# Altium project radxa_c200_io_board_v1.11.PrjPcb (part 1 of 8)
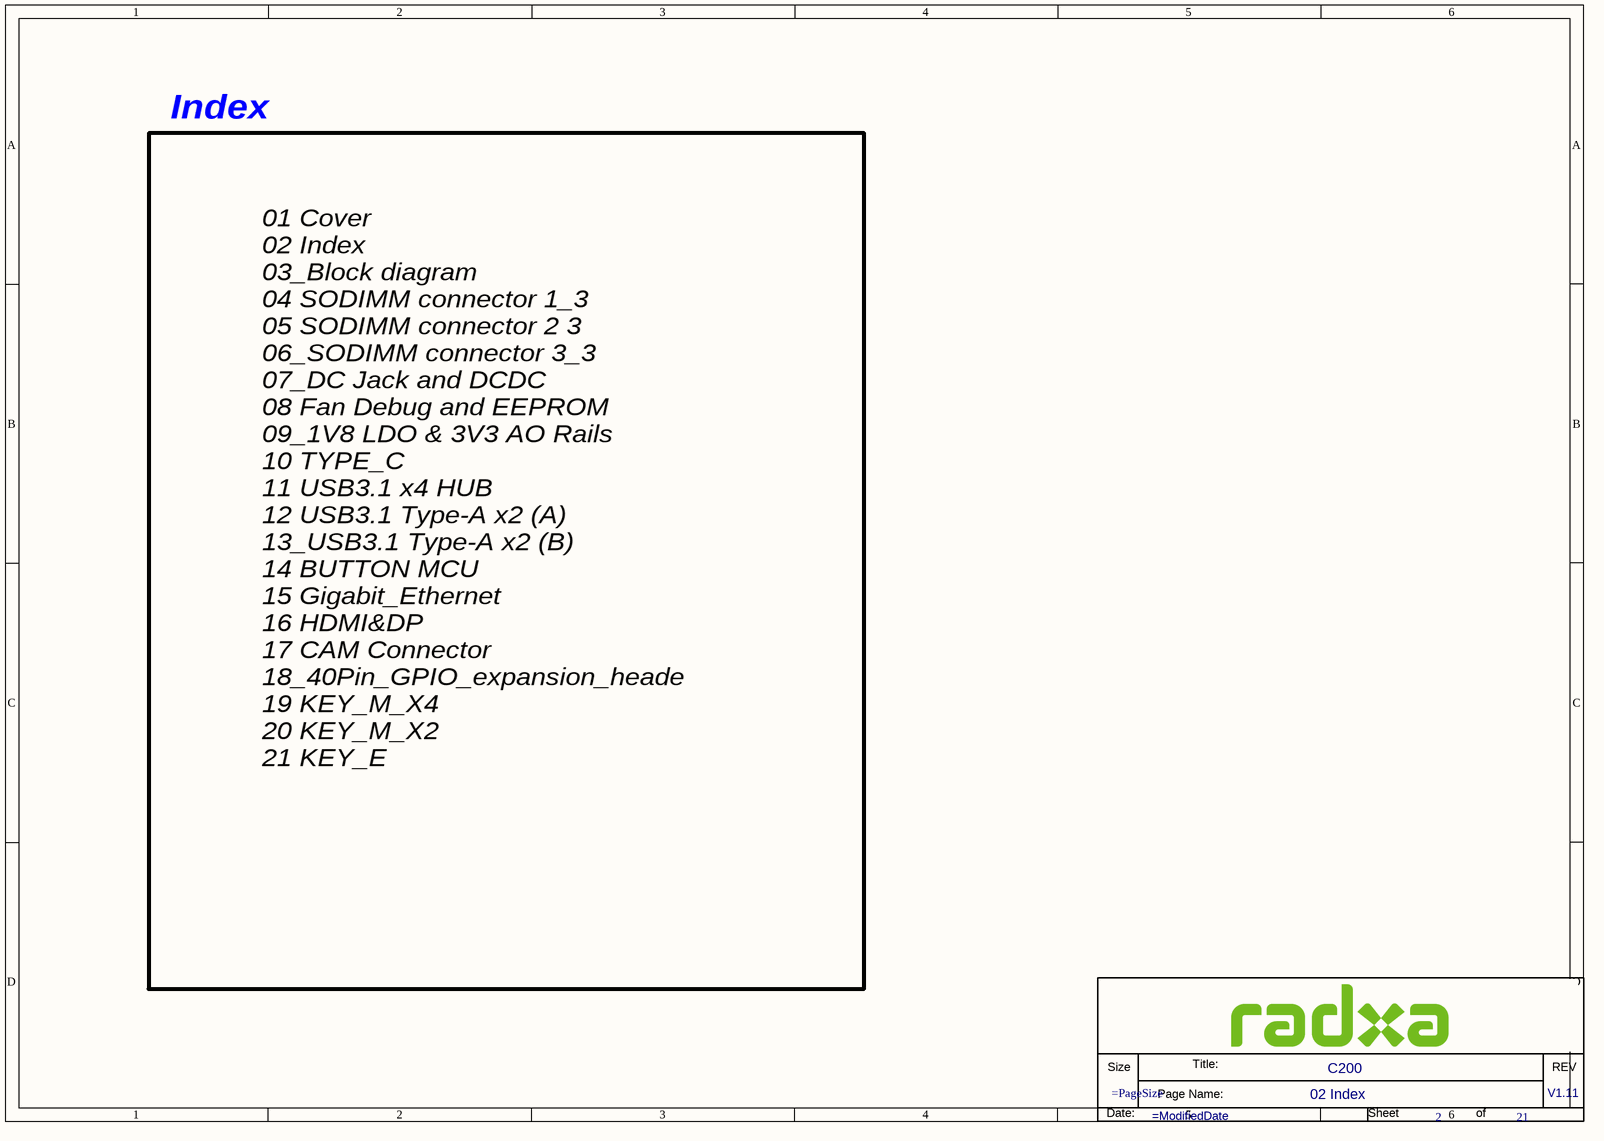
[diagram p0: 02 Index.SchDoc]
21 sheets, 649 parts. Net scope: global (net labels, ports and power ports of the same name join across sheets).
Board file: C200 V111.PcbDoc
Sheets:
  01 Cover.SchDoc
  02 Index.SchDoc
  03_Block diagram.SchDoc
  04_SODIMM connector 1_3.SchDoc
  05_SODIMM connector 2_3.SchDoc
  06_SODIMM connector 3_3.SchDoc
  07_DC Jack and DCDC.SchDoc
  08_Fan Debug and EEPROM.SchDoc
  09_1V8 LDO & 3V3 AO Rails.SchDoc
  10_TYPE_C.SchDoc
  11_USB3.1 x4 HUB.SchDoc
  12_USB3.1 Type-A x2 (A).SchDoc
  13_USB3.1 Type-A x2 (B).SchDoc
  14_BUTTON_MCU.SchDoc
  15_Gigabit_Ethernet.SchDoc
  16_HDMI&DP.SchDoc
  17_CAM_Connector.SchDoc
  18_40Pin_GPIO_expansion_heade.SchDoc
  19_KEY_M_X4.SchDoc
  20_KEY_M_X2.SchDoc
  21_KEY_E.SchDoc

## Sheet 01 Cover.SchDoc
size 297 x 209 mm; DsnPath: D:\WMS\C200\CC122\对外\C200 V1.11.DSN; SchematicName: c200; PageName: 01 Cover; PageSize: A4; TopSchematic: True

## Sheet 02 Index.SchDoc: C200
size 297 x 209 mm; Page Create Date: March  8, 1995; Page Number: 2; Page Size: A4; Comment: radxa_1010; Page Count: 21; RevCode: V1.11; Doc: 02 Index; DsnPath: D:\WMS\C200\CC122\对外\C200 V1.11.DSN; SchematicName: c200; PageName: 02 Index; PageSize: A4; TopSchematic: True

### Parts
(Parts that share a designator on the sheet are numbered #1, #2 ... from top to bottom, then left to right.)
*#1  Doc: 02 Index  RevCode: V1.11  Title: C200  Page Number: 2  Page Count: 21  (hidden comment: radxa_1010)  (graphical)

### Notes on the sheet
- Index
- 01 Cover
  02 Index
  03_Block diagram
  04 SODIMM connector 1_3
  05 SODIMM connector 2 3
  06_SODIMM connector 3_3
  07_DC Jack and DCDC
  08 Fan Debug and EEPROM
  09_1V8 LDO & 3V3 AO Rails
  10 TYPE_C
  11 USB3.1 x4 HUB
  12 USB3.1 Type-A x2 (A)
  13_USB3.1 Type-A x2 (B)
  14 BUTTON MCU
  15 Gigabit_Ethernet
  16 HDMI&DP
  17 CAM Connector
  18_40Pin_GPIO_expansion_heade
  19 KEY_M_X4
  20 KEY_M_X2
  21 KEY_E
- (in symbol radxa_1010) Size; Title:; REV; Page Name:; Date:; Sheet; of

### Library data of the parts
*#1 = radxa_1010: Page Create Date: March  8, 1995; Page Size: =PageSize; Page Modify Date: =ModifiedDate

## Sheet 03_Block diagram.SchDoc: C200
size 297 x 209 mm; Page Create Date: March  8, 1995; Page Number: 3; Page Size: A4; Comment: radxa_1010; Page Count: 21; RevCode: V1.11; Doc: 03_Block diagram; DsnPath: D:\WMS\C200\CC122\对外\C200 V1.11.DSN; SchematicName: c200; PageName: 03_Block diagram; PageSize: A4; TopSchematic: True
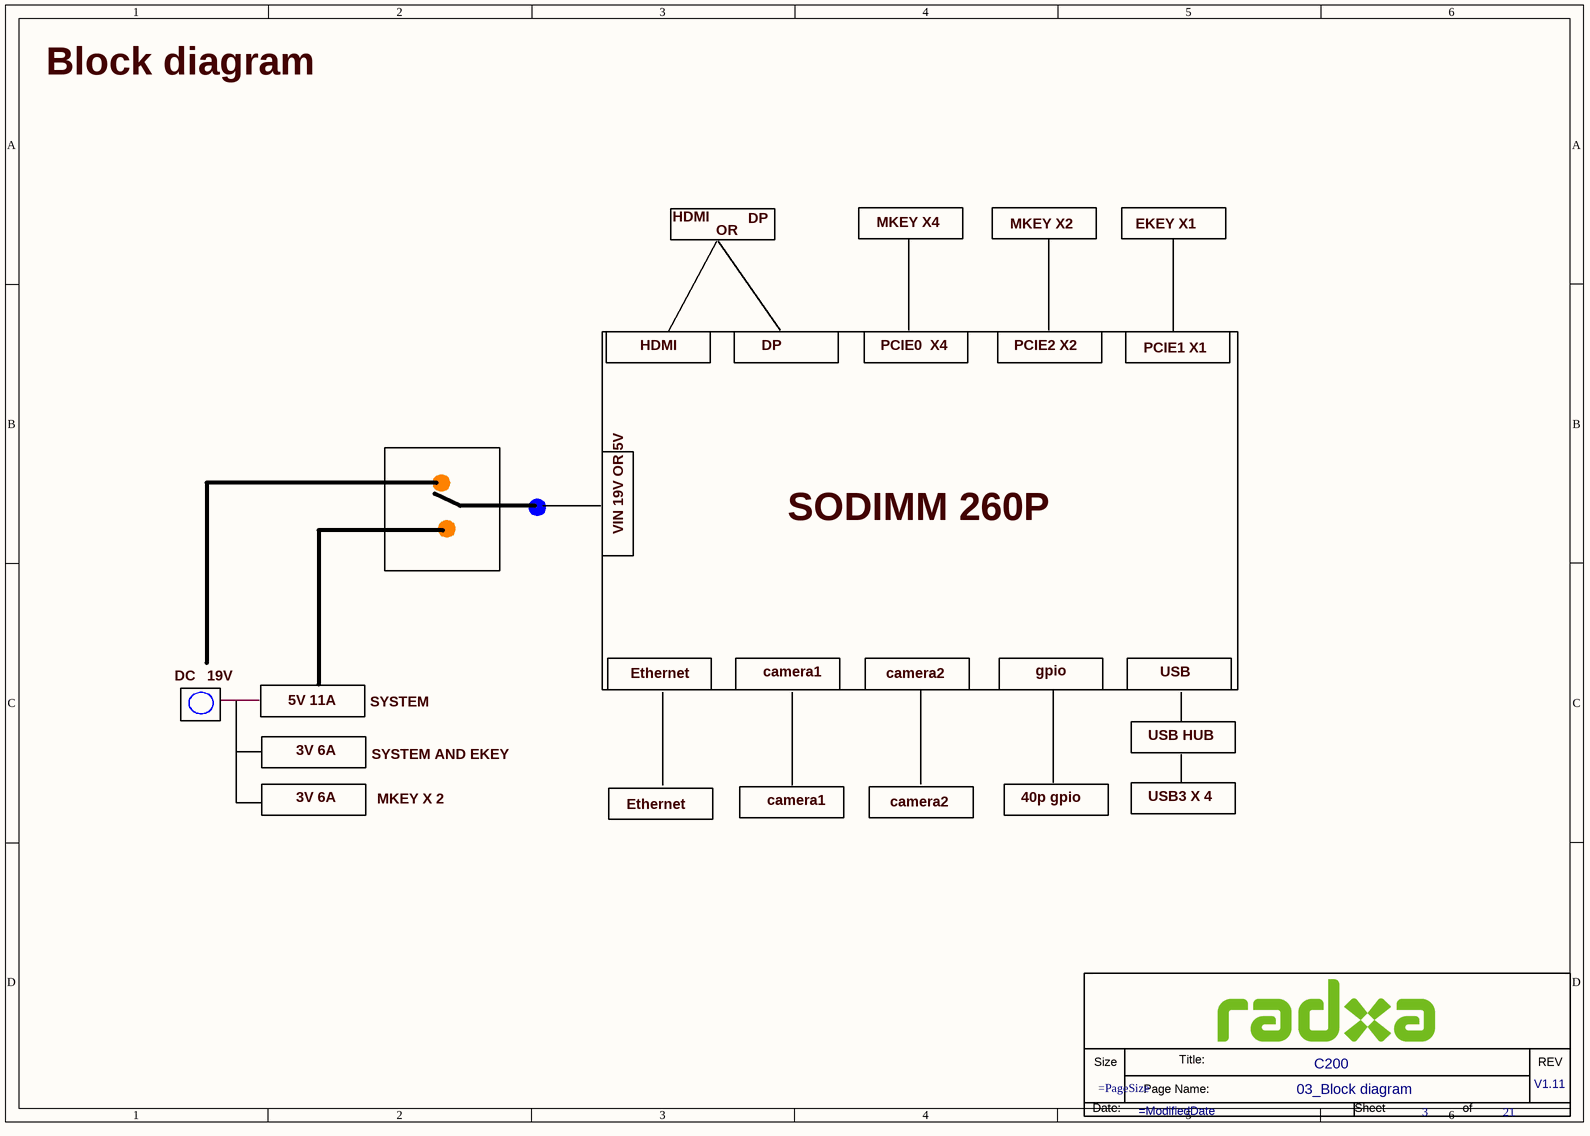
[diagram p1: 03_Block diagram.SchDoc]

### Parts
(Parts that share a designator on the sheet are numbered #1, #2 ... from top to bottom, then left to right.)
*#2  Doc: 03_Block diagram  RevCode: V1.11  Title: C200  Page Number: 3  Page Count: 21  (hidden comment: radxa_1010)  (graphical)

### Notes on the sheet
- Block diagram
- HDMI
- OR
- DP
- MKEY X4
- MKEY X2
- EKEY X1
- PCIE0  X4
- PCIE2 X2
- PCIE1 X1
- VIN 19V OR 5V
- SODIMM 260P
- camera1
- gpio
- USB
- DC
- 19V
- 5V 11A
- SYSTEM
- Ethernet
- camera2
- USB HUB
- 3V 6A
- SYSTEM AND EKEY
- MKEY X 2
- 40p gpio
- USB3 X 4
- (in symbol radxa_1010) Size; Title:; REV; Page Name:; Date:; Sheet; of

### Library data of the parts
*#2 = radxa_1010: Page Create Date: March  8, 1995; Page Size: =PageSize; Page Modify Date: =ModifiedDate

## Sheet 04_SODIMM connector 1_3.SchDoc: C200
size 594 x 420 mm; Page Create Date: March  8, 1995; Page Number: 4; Page Size: A2; Comment: radxa_1010; Page Count: 21; RevCode: V1.11; Doc: 04_SODIMM connector 1_3; DsnPath: D:\WMS\C200\CC122\对外\C200 V1.11.DSN; SchematicName: c200; PageName: 04_SODIMM connector 1_3; PageSize: A2; TopSchematic: True
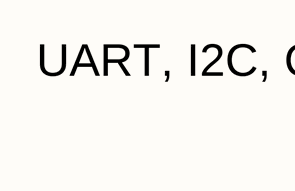
[diagram p2: 04_SODIMM connector 1_3.SchDoc, top left]
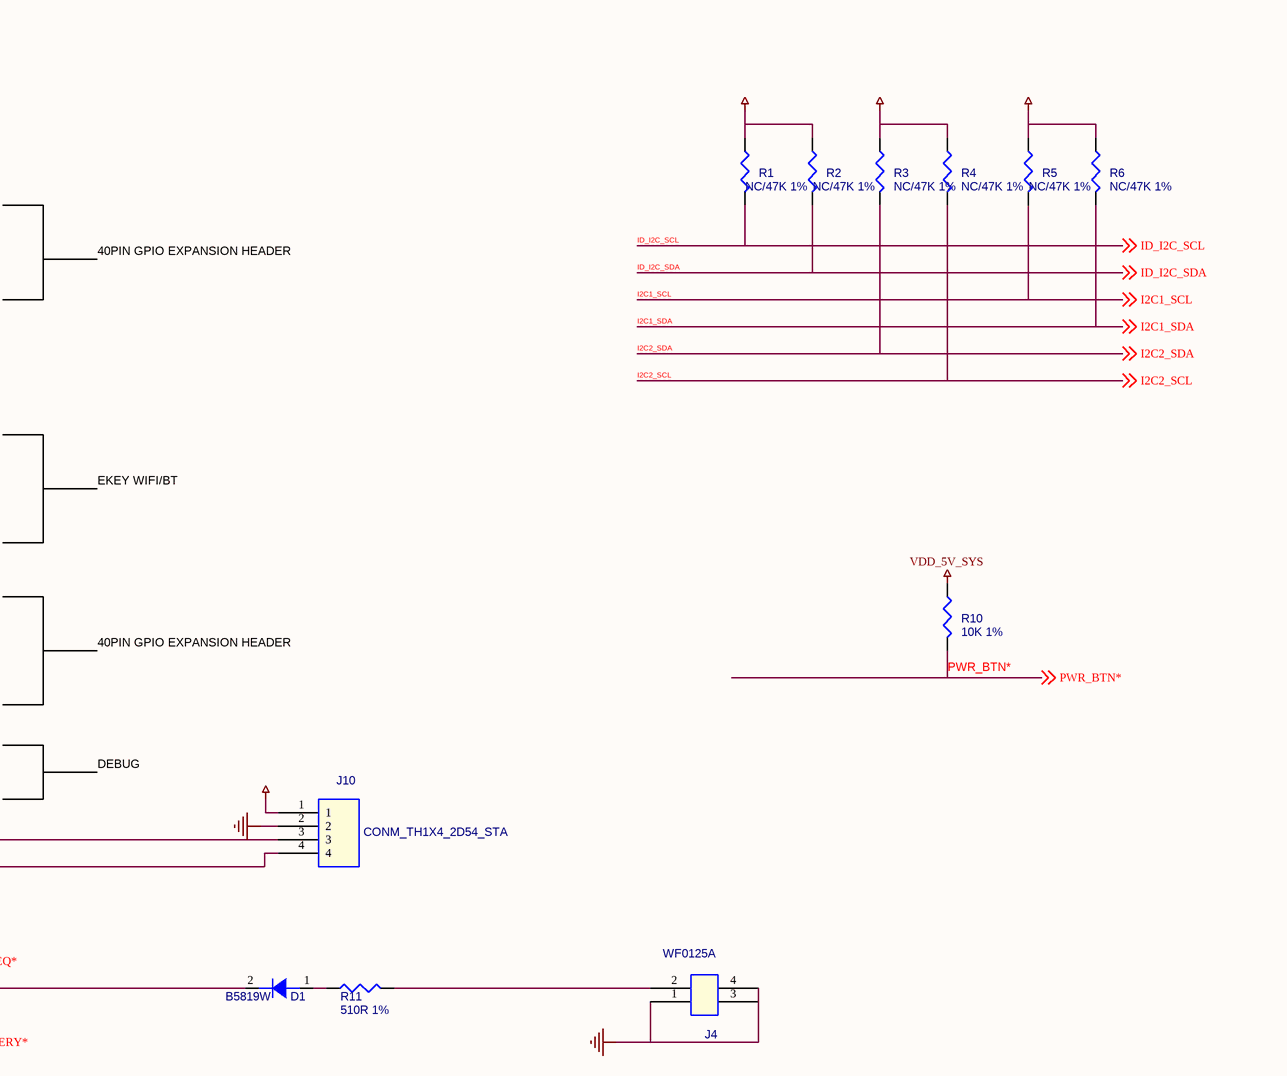
[diagram p3: 04_SODIMM connector 1_3.SchDoc, top right]
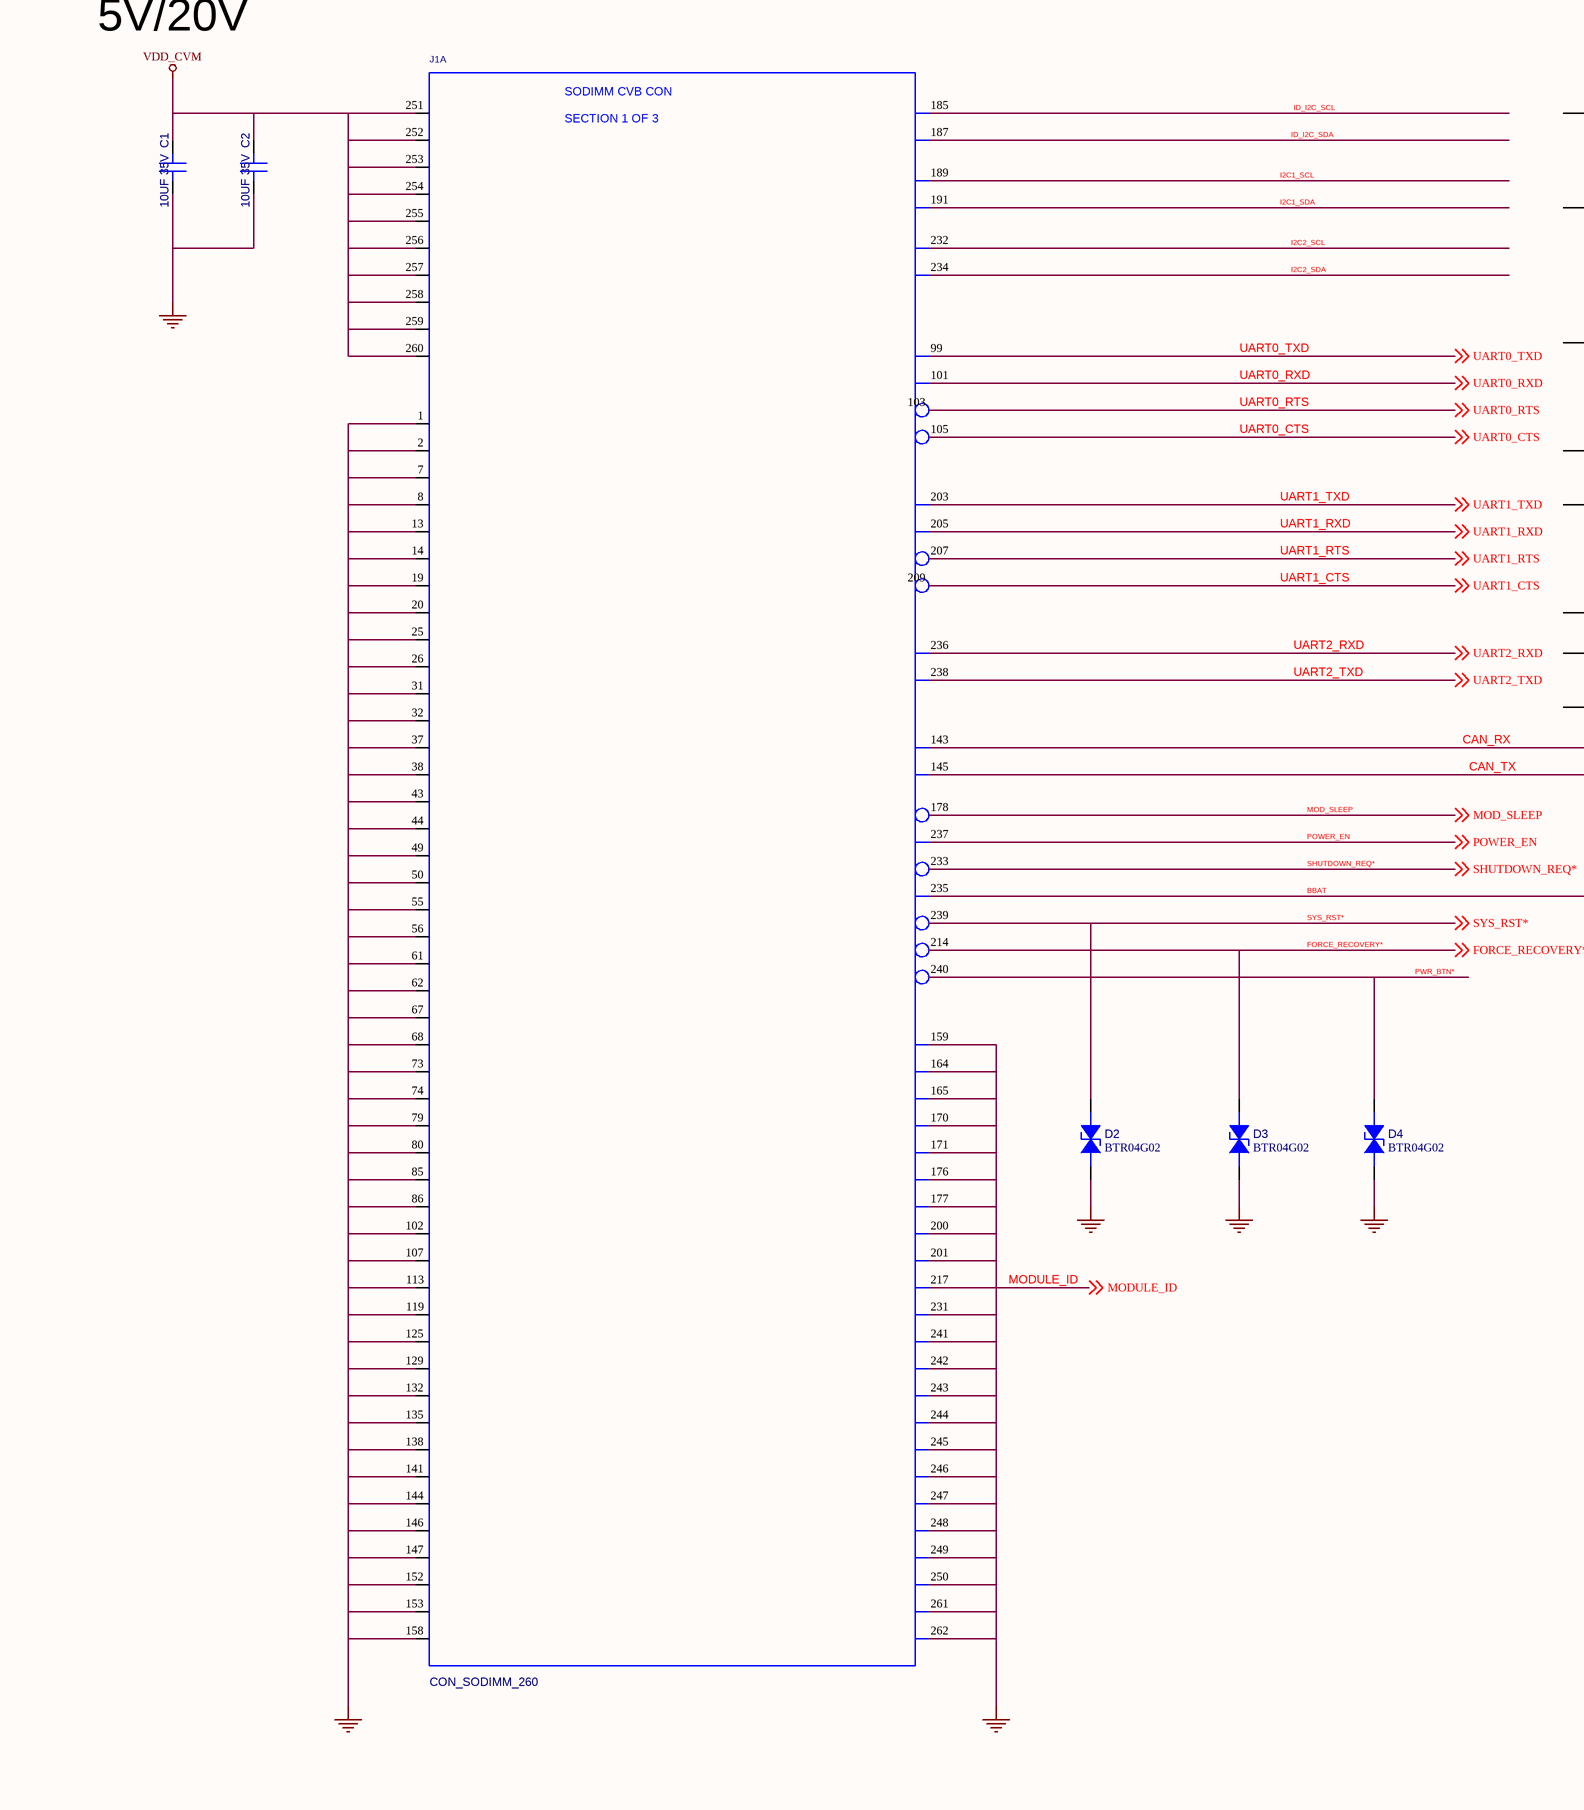
[diagram p4: 04_SODIMM connector 1_3.SchDoc, bottom left]
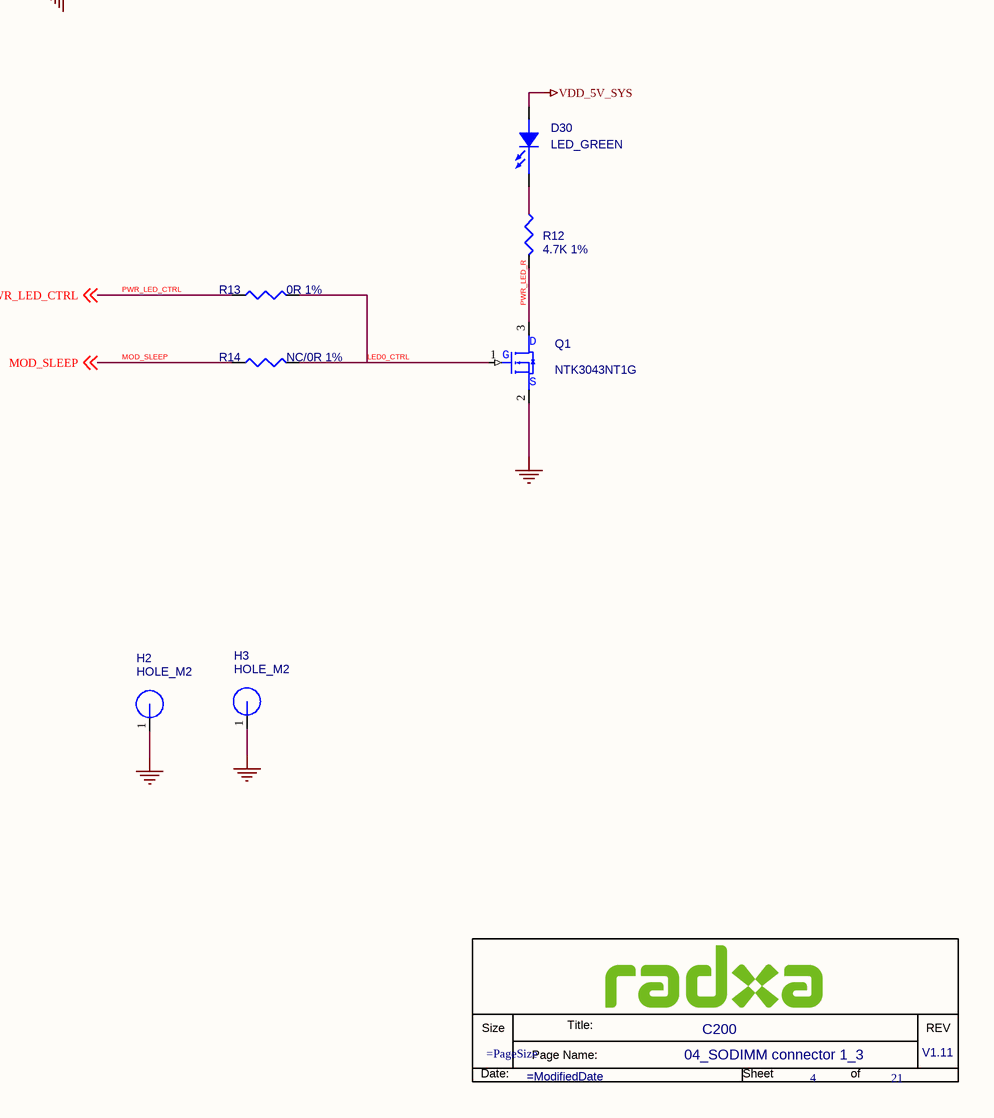
[diagram p5: 04_SODIMM connector 1_3.SchDoc, bottom right]

### Parts
(Parts that share a designator on the sheet are numbered #1, #2 ... from top to bottom, then left to right.)
*#3  Doc: 04_SODIMM connector 1_3  RevCode: V1.11  Title: C200  Page Number: 4  Page Count: 21  (hidden comment: radxa_1010)  (graphical)
C1  10UF 35V  [C1206]
C2  10UF 35V  [C1206]
D1  B5819W  [SOD_123]
D2  BTR04G02  [DFN1006-2L]
D3  BTR04G02  [DFN1006-2L]
D4  BTR04G02  [DFN1006-2L]
D30  LED_GREEN  [LED_D0603]
H2  HOLE_M2  [H3.8MM]
H3  HOLE_M2  [H3.8MM]
J1  CON_SODIMM_260  [SODIMM_SM260_0D5_78D0X26D1]  (part A of 3)
J4  WF0125A  [CON_SM1X2_1D25_LIE]
J10  CONM_TH1X4_2D54_STA  [CONM_TH1X4_2D54_STA]
Q1  NTK3043NT1G  [SOT_723]
R1  NC/47K 1%  [R0402]
R2  NC/47K 1%  [R0402]
R3  NC/47K 1%  [R0402]
R4  NC/47K 1%  [R0402]
R5  NC/47K 1%  [R0402]
R6  NC/47K 1%  [R0402]
R10  10K 1%  [R0402]
R11  510R 1%  [R0402]
R12  4.7K 1%  [R0402]
R13  0R 1%  [R0402]
R14  NC/0R 1%  [R0402]

### Nets
GND: C1.2(B) C2.2(B) D2.1(ANODE) D3.1(ANODE) D4.1(ANODE) H2.1 H3.1 J1.1(GND1) J1.2(GND2) J1.7(GND3) J1.8(GND4) J1.13(GND5) J1.14(GND6) J1.19(GND7) J1.20(GND8) J1.25(GND9) J1.26(GND10) J1.31(GND11) J1.32(GND12) J1.37(GND13) J1.38(GND14) J1.43(GND15) J1.44(GND16) J1.49(GND17) J1.50(GND18) J1.55(GND19) J1.56(GND20) J1.61(GND21) J1.62(GND22) J1.67(GND23) J1.68(GND24) J1.73(GND25) J1.74(GND26) J1.79(GND27) J1.80(GND28) J1.85(GND29) J1.86(GND30) J1.102(GND31) J1.107(GND32) J1.113(GND33) J1.119(GND34) J1.125(GND35) J1.129(GND36) J1.132(GND37) J1.135(GND38) J1.138(GND39) J1.141(GND40) J1.144(GND41) J1.146(GND42) J1.147(GND43) J1.152(GND44) J1.153(GND45) J1.158(GND46) J1.159(GND47) J1.164(GND48) J1.165(GND49) J1.170(GND50) J1.171(GND51) J1.176(GND52) J1.177(GND53) J1.200(GND54) J1.201(GND55) J1.231(GND57) J1.241(GND58) J1.242(GND59) J1.243(GND60) J1.244(GND61) J1.245(GND62) J1.246(GND63) J1.247(GND64) J1.248(GND65) J1.249(GND66) J1.250(GND67) J1.261(MNT1) J1.262(MNT2) J4.1 J4.3 J4.4 J10.2 Q1.2(S)  [project net HUB2_SSTX_N_J25]
VDD_1V8: R3.1 R4.1
VDD_3V3_SYS: J10.1 R1.1 R2.1 R5.1 R6.1  [project net 3V3]
VDD_5V_SYS: D30.1(ANODE) R10.1  [project net PC_LED+]
VDD_CVM: C1.1(A) C2.1(A) J1.251(VDD_IN1) J1.252(VDD_IN2) J1.253(VDD_IN3) J1.254(VDD_IN4) J1.255(VDD_IN5) J1.256(VDD_IN6) J1.257(VDD_IN7) J1.258(VDD_IN8) J1.259(VDD_IN9) J1.260(VDD_IN10)
BBAT: D1.2(K) J1.235(PMIC_BBAT)
CAN_RX: J1.143(CAN_RX) J10.3
CAN_TX: J1.145(CAN_TX) J10.4
FORCE_RECOVERY*: D3.2(CATHODE) J1.214(FORCE_RECOVERY*) ; off-sheet FORCE_RECOVERY*
I2C1_SCL: J1.189(GEN2_I2C_SCL) R5.2 ; off-sheet I2C1_SCL
I2C1_SDA: J1.191(GEN2_I2C_SDA) R6.2 ; off-sheet I2C1_SDA
I2C2_SCL: J1.232(GEN3_I2C_SCL) R4.2 ; off-sheet I2C2_SCL
I2C2_SDA: J1.234(GEN3_I2C_SDA) R3.2 ; off-sheet I2C2_SDA
ID_I2C_SCL: J1.185(GEN1_I2C_SCL) R1.2 ; off-sheet ID_I2C_SCL
ID_I2C_SDA: J1.187(GEN1_I2C_SDA) R2.2 ; off-sheet ID_I2C_SDA
LED0_CTRL: Q1.1(G) R13.2 R14.2
MOD_SLEEP: J1.178(GPIO_PA6) R14.1 ; off-sheet MOD_SLEEP
MODULE_ID: J1.217(GND56) ; off-sheet MODULE_ID
POWER_EN: J1.237(POWER_EN) ; off-sheet POWER_EN
PWR_BTN*: D4.2(CATHODE) J1.240(BUTTON_PWR_ON*) R10.2 ; off-sheet PWR_BTN*  [project net AUTO_ON_DIS]
PWR_LED_CTRL: R13.1 ; off-sheet PWR_LED_CTRL
PWR_LED_R: Q1.3(D) R12.2
SHUTDOWN_REQ*: J1.233(SHUTDOWN_REQ*) ; off-sheet SHUTDOWN_REQ*
SYS_RST*: D2.2(CATHODE) J1.239(SYS_RESET_IN*) ; off-sheet SYS_RST*
UART0_CTS: J1.105(UART3_CTS) ; off-sheet UART0_CTS
UART0_RTS: J1.103(UART3_RTS) ; off-sheet UART0_RTS
UART0_RXD: J1.101(UART3_RXD) ; off-sheet UART0_RXD
UART0_TXD: J1.99(UART3_TXD) ; off-sheet UART0_TXD
UART1_CTS: J1.209(UART2_CTS) ; off-sheet UART1_CTS
UART1_RTS: J1.207(UART2_RTS) ; off-sheet UART1_RTS
UART1_RXD: J1.205(UART2_RXD) ; off-sheet UART1_RXD
UART1_TXD: J1.203(UART2_TXD) ; off-sheet UART1_TXD
UART2_RXD: J1.236(UART1_TXD) ; off-sheet UART2_RXD
UART2_TXD: J1.238(UART1_RXD) ; off-sheet UART2_TXD
NetD1_1: D1.1(A) R11.2
NetD30_2: D30.2 R12.1
NetJ4_2: J4.2 R11.1

### Notes on the sheet
- UART, I2C, CAN and GPIOs
- 5V/20V
- 40PIN GPIO EXPANSION HEADER
- EKEY WIFI/BT
- DEBUG
- (in symbol CON_SODIMM_260, part A) SODIMM CVB CON; SECTION 1 OF 3
- (in symbol radxa_1010) Title:; Size; REV; Page Name:; Date:; Sheet; of

### Library data of the parts
C1 = C: SMD  1206  10UF  35V  X5R  ±10%  ROHS; PARTS: 1; Part Reference: C1; Part Number: A1C01.00333; OriginalSymbolOrigin: (0,30); PKG_TYPE: CAP2-100-250; LEVEL: STD; PINSWAP: (A,B); Value: 10UF 35V; Part Type: 陶瓷电容; PCB Footprint: C1206
C2 = C: SMD  1206  10UF  35V  X5R  ±10%  ROHS; PARTS: 1; Part Reference: C2; Part Number: A1C01.00333; OriginalSymbolOrigin: (0,30); PKG_TYPE: CAP2-100-250; LEVEL: STD; PINSWAP: (A,B); Value: 10UF 35V; Part Type: 陶瓷电容; PCB Footprint: C1206
D1 = DIODE: SMD  编带  SOD-123  B5819W  长电  ROHS; Part Reference: D1; Part Number: A1D02.00010; Manufacturer PN: SS32; Manufacturer: 星海; Priority: A; PCB Footprint: SOD_123; Value: B5819W; Created by: JJJ; Part Type: 二极管-ESD管-桥堆-TVS管; RK PN: SS32
D2 = ESD: SMD  编带  0402  BTR04G02  B-tron  ROHS; Part Reference: D2; Part Number: A1D02.00002; Parameter: ESD-台舟 ESD5341N-封装 esd0402; ID: DE-E0004; Temp Coeff: -50℃ ~ +125℃; PCB Footprint: ESD_D0402; Value: BTR04G02; Part Type: 二极管-ESD管-桥堆-TVS管
D3 = ESD: SMD  编带  0402  BTR04G02  B-tron  ROHS; Part Reference: D3; Part Number: A1D02.00002; Parameter: ESD-台舟 ESD5341N-封装 esd0402; ID: DE-E0004; Temp Coeff: -50℃ ~ +125℃; PCB Footprint: ESD_D0402; Value: BTR04G02; Part Type: 二极管-ESD管-桥堆-TVS管
D4 = ESD: SMD  编带  0402  BTR04G02  B-tron  ROHS; Part Reference: D4; Part Number: A1D02.00002; Parameter: ESD-台舟 ESD5341N-封装 esd0402; ID: DE-E0004; Temp Coeff: -50℃ ~ +125℃; PCB Footprint: ESD_D0402; Value: BTR04G02; Part Type: 二极管-ESD管-桥堆-TVS管
D30 = LED: SMD  编带  0603  发绿光  单色  mcd=150  IF=20mA  无色散光  EY-TB0603GC-010F  恩域光电  ROHS; Part Reference: D30; Part Number: A1D03.00002; Temp Coeff: -40℃ to +85℃; Value: LED_GREEN; Part Type: 发光二极管; PCB Footprint: LED_D0603
H2 = HOLE: Part Reference: H2; PCB Footprint: HOLE_2D7_6D0_A; RK PN: HOLE_3R50; Priority: A; Value: HOLE_M2; Part Type: HOLE
H3 = HOLE: Part Reference: H3; PCB Footprint: HOLE_2D7_6D0_A; RK PN: HOLE_3R50; Priority: A; Value: HOLE_M2; Part Type: HOLE
J1 = CON_SODIMM_260: SMD  母座  立贴  0.5mm脚距  AS0AA826-EASB0-7H  Foxconn  ROHS; Part Reference: J1; Part Number: A1J01.00015; OriginalSymbolOrigin: (-950,2300); ANGLE: ?; ASSEMBLY: ?; EMI_GROUND_TAB: ?; GENDER: ?; LATCHING: ?; MAX_CURRENT: ?; MAX_VOLTAGE: ?; NV_NAME: ?; NV_PN: ?; PACK_TYPE: ?; PATH: ?; PITCH: ?; PLACEMENT_NOTE: ?; REFLOW: ?; SHIELDED: ?; SHROUDED: ?; SKU: COMMON; Value: CON_SODIMM_260; Part Type: 连接座; PCB Footprint: SODIMM_SM260_0D5_78D0X26D1
J4 = CON1X2: SMD  母座  1*2PIN  180度  卧贴  1.25mm脚距  耐高温  5001—C—2R1-00  米黄色  文章济美  ROHS; Part Reference: J4; Part Number: A1J01.00027; Value: WF0125A; Part Type: 连接座; PCB Footprint: CON_SM1X2_1D25_LIE
J10 = CONM_TH1X4_2D54_STA: Part Reference: J10; Value: CONM_TH1X4_2D54_STA; PCB Footprint: CONM_TH1X4_2D54_STA
Q1 = MOSFET_NPN: SMD  编带  SOT-723  NTK3043NT1G  N沟道  ON  ROHS; Part Reference: Q1; Part Number: A1D01.00069; Temp Coeff: -55℃ to ＋150℃; Value: NTK3043NT1G; Part Type: 三极管-MOS管; PCB Footprint: SOT_723
R1 = R: SMD  0402  47K  1/16W  ±1%  ROHS; Part Reference: R1; Part Number: A1R01.00248; CDS_PART_NAME: R_0402-47K,5 %,62.5MW,195-0599-000; CDS_PHYS_PART_NAME: R_0402-47K,5 %,62.5MW,195-0599-000-195-0599-000,47K; ASSEMBLY: CVB_CONN; CDS_LIB: discrete; CDS_SEC: 1; DEVICE_TYPENAME: R_0402-47K5625MW195-0599-000-195-0599-00047K; DRAWING: @P3449_B01_LIB.P3449_B01(SCH_1):PAGE4; LOCATION: R63; MAX_WATTAGE: 62.5mW; NV_PN: 195-0599-000; PACK_TYPE: 402; PATH: I62; PHYS_PAGE: 4; ROT: 0; SIGNAL_MODEL: nv_res; TOL: 5%; VER: 2; XY: (-2450,6850); PCB Footprint: R0402; Value: NC/47K 1%; Part Type: 贴片电阻; CHIPS_PART_NAME: R; SEC: 1; SKU: NO STUFF
R2 = R: SMD  0402  47K  1/16W  ±1%  ROHS; Part Reference: R2; Part Number: A1R01.00248; CDS_PART_NAME: R_0402-47K,5 %,62.5MW,195-0599-000; CDS_PHYS_PART_NAME: R_0402-47K,5 %,62.5MW,195-0599-000-195-0599-000,47K; ASSEMBLY: CVB_CONN; CDS_LIB: discrete; CDS_SEC: 1; DEVICE_TYPENAME: R_0402-47K5625MW195-0599-000-195-0599-00047K; DRAWING: @P3449_B01_LIB.P3449_B01(SCH_1):PAGE4; LOCATION: R64; MAX_WATTAGE: 62.5mW; NV_PN: 195-0599-000; PACK_TYPE: 402; PATH: I63; PHYS_PAGE: 4; ROT: 0; SIGNAL_MODEL: nv_res; TOL: 5%; VER: 2; XY: (-2200,6850); PCB Footprint: R0402; Value: NC/47K 1%; Part Type: 贴片电阻; CHIPS_PART_NAME: R; SEC: 1; SKU: NO STUFF
R3 = R: SMD  0402  47K  1/16W  ±1%  ROHS; Part Reference: R3; Part Number: A1R01.00248; CDS_PART_NAME: R_0402-47K,5 %,62.5MW,195-0599-000; CDS_PHYS_PART_NAME: R_0402-47K,5 %,62.5MW,195-0599-000-195-0599-000,47K; ASSEMBLY: CVB_CONN; CDS_LIB: discrete; CDS_SEC: 1; DEVICE_TYPENAME: R_0402-47K5625MW195-0599-000-195-0599-00047K; DRAWING: @P3449_B01_LIB.P3449_B01(SCH_1):PAGE4; LOCATION: R65; MAX_WATTAGE: 62.5mW; NV_PN: 195-0599-000; PACK_TYPE: 402; PATH: I64; PHYS_PAGE: 4; ROT: 0; SIGNAL_MODEL: nv_res; TOL: 5%; VER: 2; XY: (-1950,6850); PCB Footprint: R0402; Value: NC/47K 1%; Part Type: 贴片电阻; CHIPS_PART_NAME: R; SEC: 1; SKU: NO STUFF
R4 = R: SMD  0402  47K  1/16W  ±1%  ROHS; Part Reference: R4; Part Number: A1R01.00248; CDS_PART_NAME: R_0402-47K,5 %,62.5MW,195-0599-000; CDS_PHYS_PART_NAME: R_0402-47K,5 %,62.5MW,195-0599-000-195-0599-000,47K; ASSEMBLY: CVB_CONN; CDS_LIB: discrete; CDS_SEC: 1; DEVICE_TYPENAME: R_0402-47K5625MW195-0599-000-195-0599-00047K; DRAWING: @P3449_B01_LIB.P3449_B01(SCH_1):PAGE4; LOCATION: R66; MAX_WATTAGE: 62.5mW; NV_PN: 195-0599-000; PACK_TYPE: 402; PATH: I65; PHYS_PAGE: 4; ROT: 0; SIGNAL_MODEL: nv_res; TOL: 5%; VER: 2; XY: (-1700,6850); PCB Footprint: R0402; Value: NC/47K 1%; Part Type: 贴片电阻; CHIPS_PART_NAME: R; SEC: 1; SKU: NO STUFF
R5 = R: SMD  0402  47K  1/16W  ±1%  ROHS; Part Reference: R5; Part Number: A1R01.00248; CDS_PART_NAME: R_0402-47K,5 %,62.5MW,195-0599-000; CDS_PHYS_PART_NAME: R_0402-47K,5 %,62.5MW,195-0599-000-195-0599-000,47K; ASSEMBLY: CVB_CONN; CDS_LIB: discrete; CDS_SEC: 1; DEVICE_TYPENAME: R_0402-47K5625MW195-0599-000-195-0599-00047K; DRAWING: @P3449_B01_LIB.P3449_B01(SCH_1):PAGE4; LOCATION: R67; MAX_WATTAGE: 62.5mW; NV_PN: 195-0599-000; PACK_TYPE: 402; PATH: I66; PHYS_PAGE: 4; ROT: 0; SIGNAL_MODEL: nv_res; TOL: 5%; VER: 2; XY: (-1400,6850); PCB Footprint: R0402; Value: NC/47K 1%; Part Type: 贴片电阻; CHIPS_PART_NAME: R; SEC: 1; SKU: NO STUFF
R6 = R: SMD  0402  47K  1/16W  ±1%  ROHS; Part Reference: R6; Part Number: A1R01.00248; CDS_PART_NAME: R_0402-47K,5 %,62.5MW,195-0599-000; CDS_PHYS_PART_NAME: R_0402-47K,5 %,62.5MW,195-0599-000-195-0599-000,47K; ASSEMBLY: CVB_CONN; CDS_LIB: discrete; CDS_SEC: 1; DEVICE_TYPENAME: R_0402-47K5625MW195-0599-000-195-0599-00047K; DRAWING: @P3449_B01_LIB.P3449_B01(SCH_1):PAGE4; LOCATION: R68; MAX_WATTAGE: 62.5mW; NV_PN: 195-0599-000; PACK_TYPE: 402; PATH: I67; PHYS_PAGE: 4; ROT: 0; SIGNAL_MODEL: nv_res; TOL: 5%; VER: 2; XY: (-1150,6850); PCB Footprint: R0402; Value: NC/47K 1%; Part Type: 贴片电阻; CHIPS_PART_NAME: R; SEC: 1; SKU: NO STUFF
R10 = R: SMD  0402  10K  1/16W  ±1%  ROHS; Part Reference: R10; Part Number: A1R01.00222; CDS_PHYS_PART_NAME: R_0402-10K,5 %,62.5MW,195-0486-000-10K,195-0486-000; CDS_PART_NAME: R_0402-10K,5 %,62.5MW,195-0486-000; SEC: 1; XY: (-1400,3900); VER: 2; TOL: 5%; SIGNAL_MODEL: nv_res; ROT: 0; PHYS_PAGE: 4; PATH: I76; PACK_TYPE: 402; NV_PN: 195-0486-000; MAX_WATTAGE: 62.5mW; LOCATION: R164; DRAWING: @P3449_B01_LIB.P3449_B01(SCH_1):PAGE4; DEVICE_TYPENAME: R_0402-10K5625MW195-0486-000-10K195-0486-000; CDS_LIB: discrete; ASSEMBLY: CVB_CONN; PCB Footprint: R0402; Value: 10K 1%; Part Type: 贴片电阻; CHIPS_PART_NAME: R; CDS_SEC: 1
R11 = R: SMD  0402  510R  1/16W  ±1%  ROHS; Part Reference: R11; Part Number: A1R01.00312; PCB Footprint: R0402; Value: 510R 1%; Part Type: 贴片电阻
R12 = R: SMD  0402  4.7K  1/16W  ±1%  ROHS; Part Reference: R12; Part Number: A1R01.00250; CDS_PHYS_PART_NAME: R_0402-1.8K,5 %,62.5MW,195-0528-000-1.8K,195-0528-000; CDS_PART_NAME: R_0402-1.8K,5 %,62.5MW,195-0528-000; SEC: 1; XY: (-1550,2000); VER: 2; TOL: 5%; SIGNAL_MODEL: nv_res; ROT: 0; PHYS_PAGE: 4; PATH: I94; PACK_TYPE: 402; NV_PN: 195-0528-000; MAX_WATTAGE: 62.5mW; LOCATION: R297; DRAWING: @P3449_B01_LIB.P3449_B01(SCH_1):PAGE4; DEVICE_TYPENAME: R_0402-18K5625MW195-0528-000-18K195-0528-000; CDS_LIB: discrete; ASSEMBLY: POWER_LED; PCB Footprint: R0402; Value: 4.7K 1%; Part Type: 贴片电阻; CHIPS_PART_NAME: R; CDS_SEC: 1
R13 = R: SMD  0402  0R  1/16W  ±1%  ROHS; Part Reference: R13; Part Number: A1R01.00219; PCB Footprint: R0402; Value: 0R 1%; Part Type: 贴片电阻
R14 = R: SMD  0402  0R  1/16W  ±1%  ROHS; Part Reference: R14; Part Number: A1R01.00219; PCB Footprint: R0402; Value: NC/0R 1%; Part Type: 贴片电阻
*#3 = radxa_1010: Page Create Date: March  8, 1995; Page Size: =PageSize; Page Modify Date: =ModifiedDate

## Sheet 05_SODIMM connector 2_3.SchDoc: C200
size 594 x 420 mm; Page Create Date: March  8, 1995; Page Number: 5; Page Size: A2; Comment: radxa_1010; Page Count: 21; RevCode: V1.11; Doc: 05_SODIMM connector 2_3; DsnPath: D:\WMS\C200\CC122\对外\C200 V1.11.DSN; SchematicName: c200; PageName: 05_SODIMM connector 2_3; PageSize: A2; TopSchematic: True
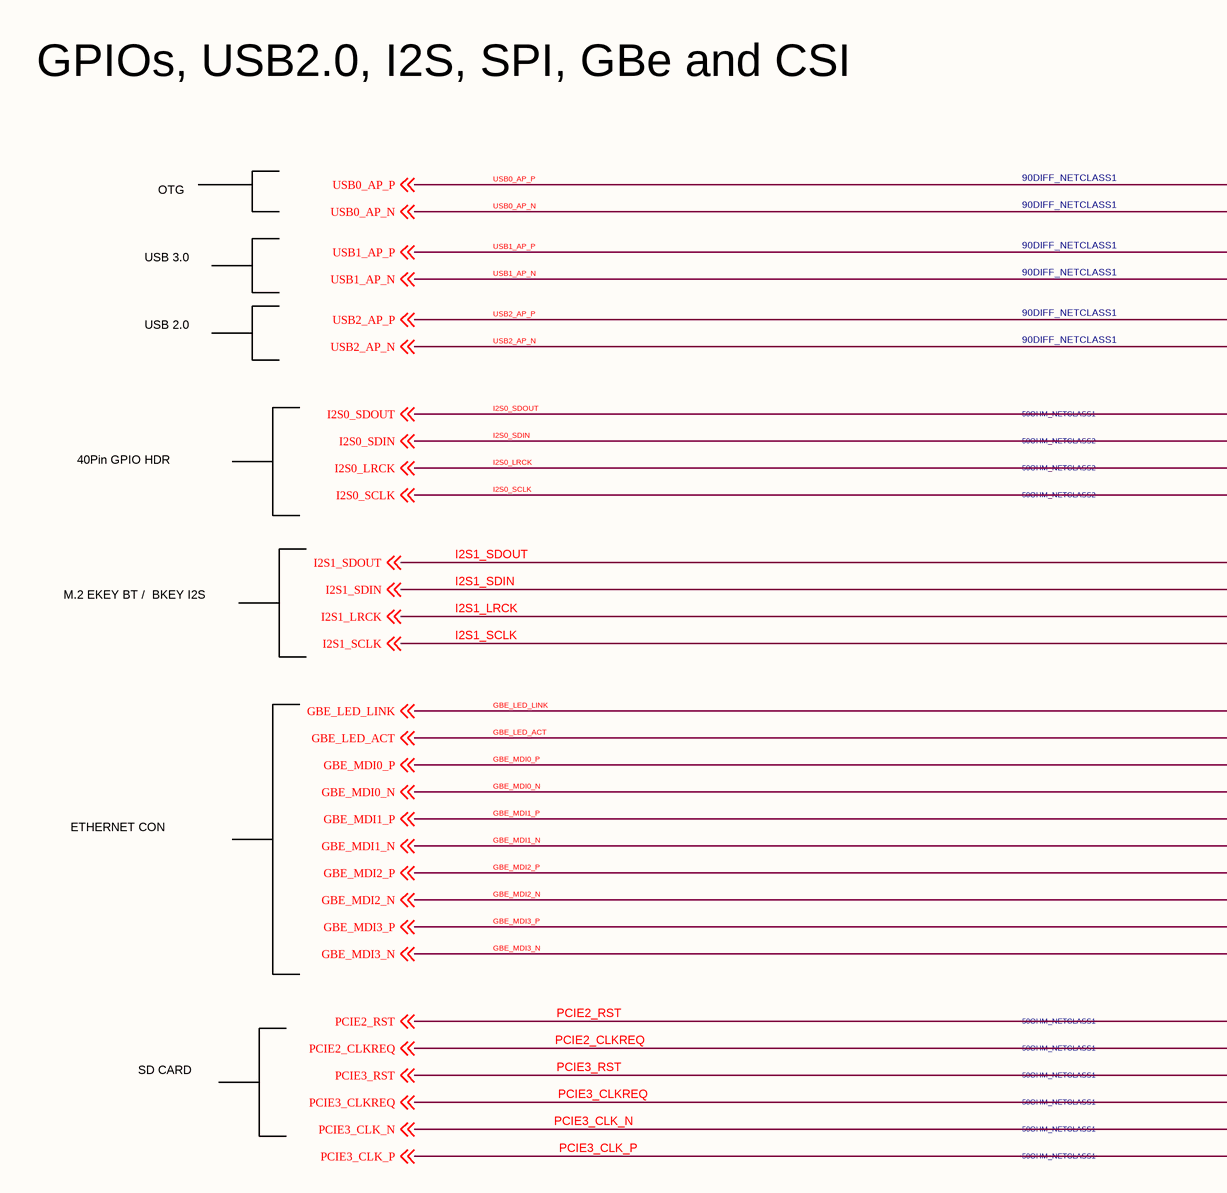
[diagram p6: 05_SODIMM connector 2_3.SchDoc, top left]
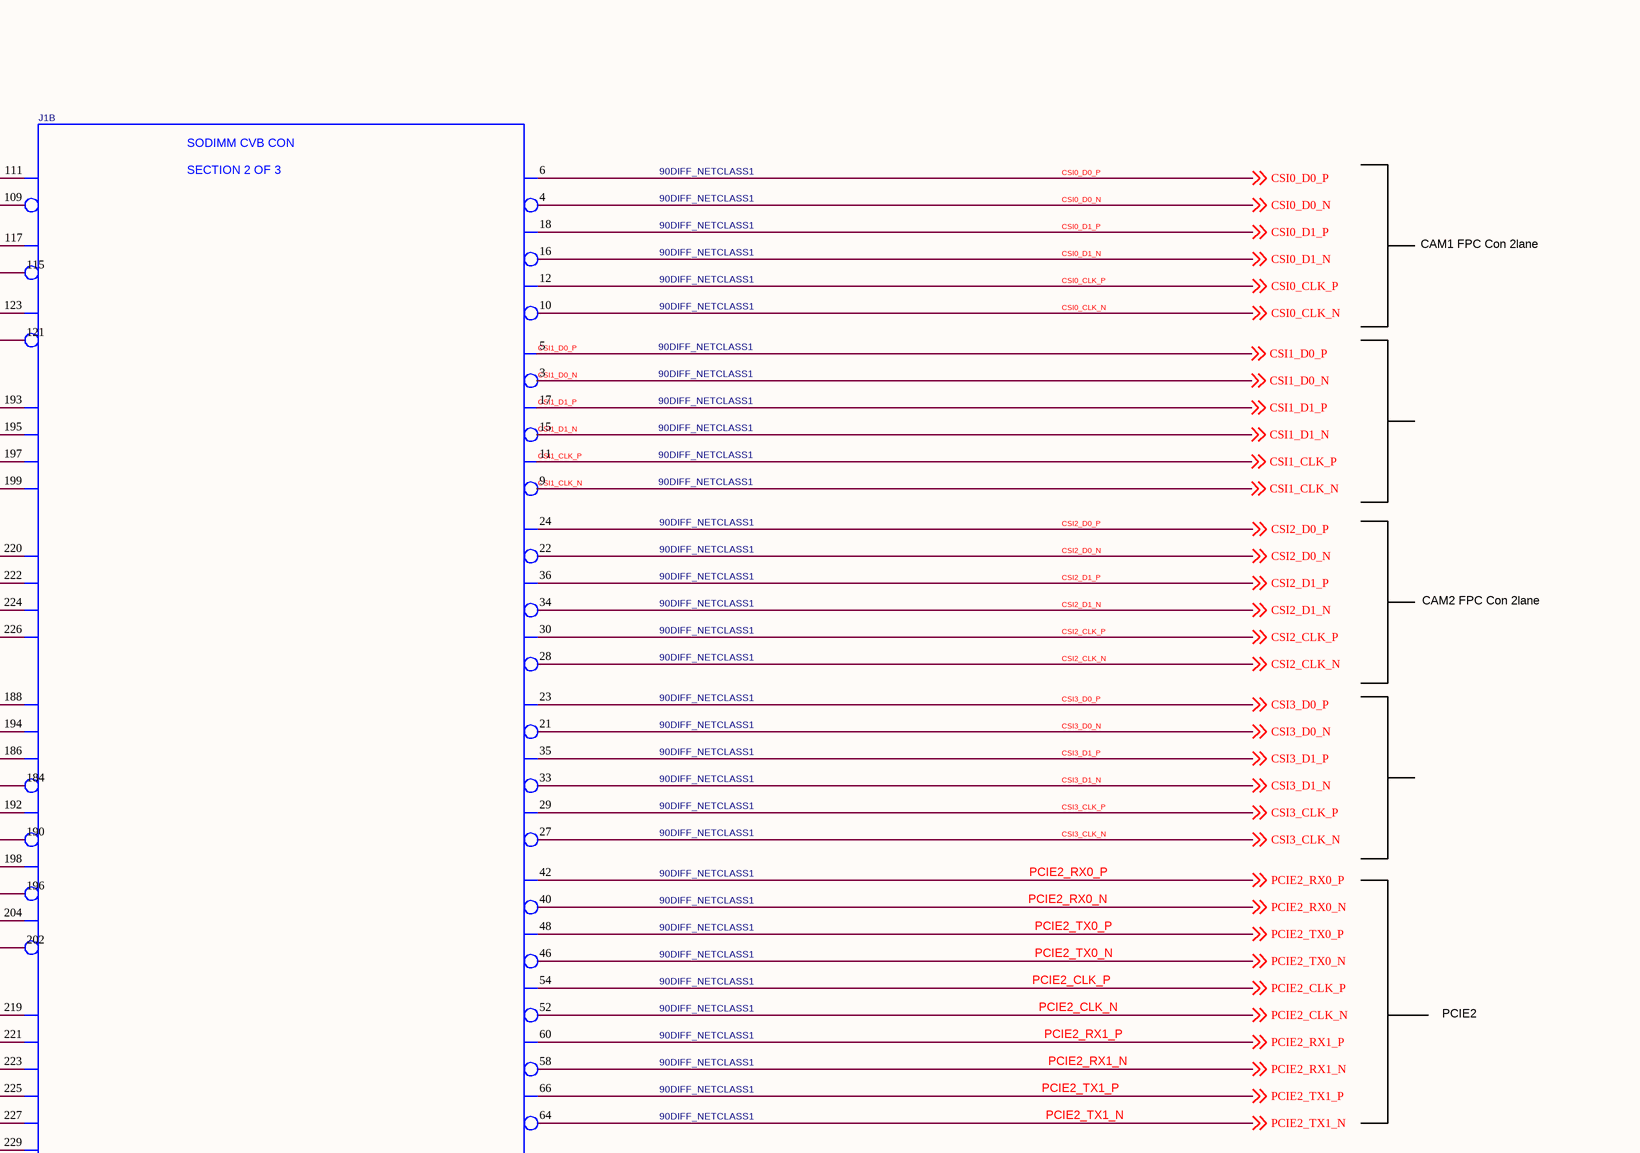
[diagram p7: 05_SODIMM connector 2_3.SchDoc, top right]
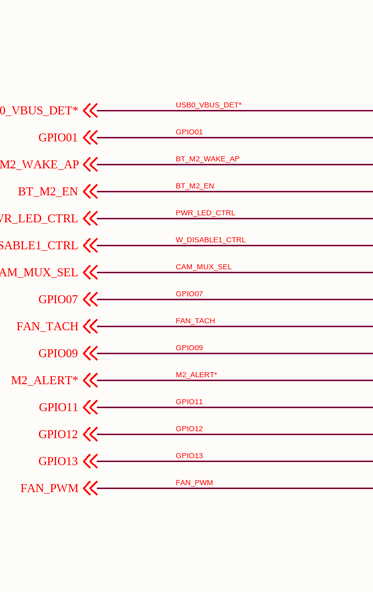
[diagram p8: 05_SODIMM connector 2_3.SchDoc, bottom left]
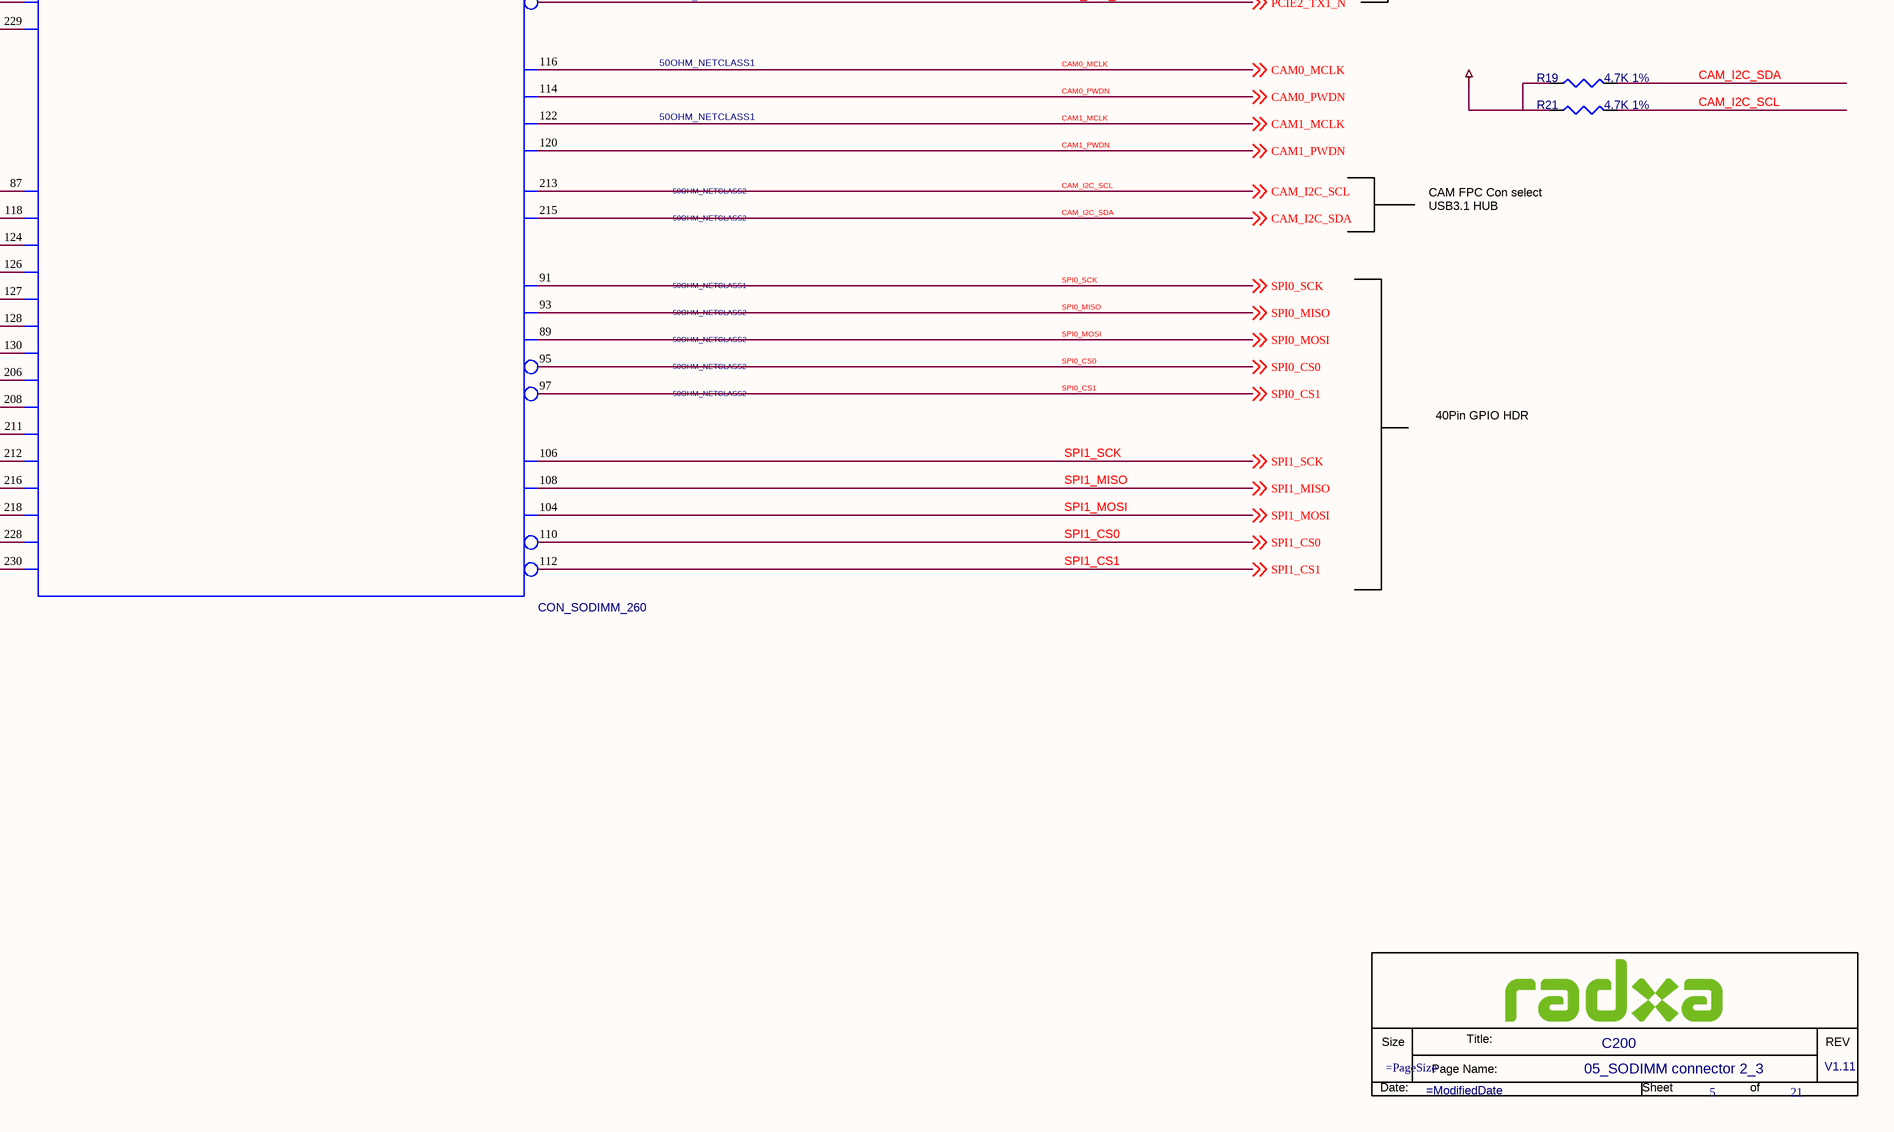
[diagram p9: 05_SODIMM connector 2_3.SchDoc, bottom right]

### Parts
(Parts that share a designator on the sheet are numbered #1, #2 ... from top to bottom, then left to right.)
*#4  Doc: 05_SODIMM connector 2_3  RevCode: V1.11  Title: C200  Page Number: 5  Page Count: 21  (hidden comment: radxa_1010)  (graphical)
J1  CON_SODIMM_260  [SODIMM_SM260_0D5_78D0X26D1]  (part B of 3)
R19  4.7K 1%  [R0402]
R21  4.7K 1%  [R0402]

### Nets
VDD_3V3_SYS: R19.1 R21.1  [project net 3V3]
BT_M2_EN: J1.126(GPS_EN) ; off-sheet BT_M2_EN
BT_M2_WAKE_AP: J1.124(GPIO_PH6) ; off-sheet BT_M2_WAKE_AP
CAM0_MCLK: J1.116(CAM1_MCLK) ; off-sheet CAM0_MCLK
CAM0_PWDN: J1.114(CAM1_PWDN) ; off-sheet CAM0_PWDN
CAM1_MCLK: J1.122(CAM2_MCLK) ; off-sheet CAM1_MCLK
CAM1_PWDN: J1.120(CAM2_PWDN) ; off-sheet CAM1_PWDN
CAM_I2C_SCL: J1.213(CAM_I2C_SCL) R21.2 ; off-sheet CAM_I2C_SCL
CAM_I2C_SDA: J1.215(CAM_I2C_SDA) R19.2 ; off-sheet CAM_I2C_SDA
CAM_MUX_SEL: J1.130(NFC_EN) ; off-sheet CAM_MUX_SEL
CSI0_CLK_N: J1.10(CSI_A_CLK_N) ; off-sheet CSI0_CLK_N
CSI0_CLK_P: J1.12(CSI_A_CLK_P) ; off-sheet CSI0_CLK_P
CSI0_D0_N: J1.4(CSI_A_D0_N) ; off-sheet CSI0_D0_N
CSI0_D0_P: J1.6(CSI_A_D0_P) ; off-sheet CSI0_D0_P
CSI0_D1_N: J1.16(CSI_A_D1_N) ; off-sheet CSI0_D1_N
CSI0_D1_P: J1.18(CSI_A_D1_P) ; off-sheet CSI0_D1_P
CSI1_CLK_N: J1.9(CSI_B_CLK_N) ; off-sheet CSI1_CLK_N
CSI1_CLK_P: J1.11(CSI_B_CLK_P) ; off-sheet CSI1_CLK_P
CSI1_D0_N: J1.3(CSI_B_D0_N) ; off-sheet CSI1_D0_N
CSI1_D0_P: J1.5(CSI_B_D0_P) ; off-sheet CSI1_D0_P
CSI1_D1_N: J1.15(CSI_B_D1_N) ; off-sheet CSI1_D1_N
CSI1_D1_P: J1.17(CSI_B_D1_P) ; off-sheet CSI1_D1_P
CSI2_CLK_N: J1.28(CSI_E_CLK_N) ; off-sheet CSI2_CLK_N
CSI2_CLK_P: J1.30(CSI_E_CLK_P) ; off-sheet CSI2_CLK_P
CSI2_D0_N: J1.22(CSI_E_D0_N) ; off-sheet CSI2_D0_N
CSI2_D0_P: J1.24(CSI_E_D0_P) ; off-sheet CSI2_D0_P
CSI2_D1_N: J1.34(CSI_E_D1_N) ; off-sheet CSI2_D1_N
CSI2_D1_P: J1.36(CSI_E_D1_P) ; off-sheet CSI2_D1_P
CSI3_CLK_N: J1.27(CSI_F_CLK_N) ; off-sheet CSI3_CLK_N
CSI3_CLK_P: J1.29(CSI_F_CLK_P) ; off-sheet CSI3_CLK_P
CSI3_D0_N: J1.21(CSI_F_D0_N) ; off-sheet CSI3_D0_N
CSI3_D0_P: J1.23(CSI_F_D0_P) ; off-sheet CSI3_D0_P
CSI3_D1_N: J1.33(CSI_F_D1_N) ; off-sheet CSI3_D1_N
CSI3_D1_P: J1.35(CSI_F_D1_P) ; off-sheet CSI3_D1_P
FAN_PWM: J1.230(GPIO_PE7) ; off-sheet FAN_PWM
FAN_TACH: J1.208(GPIO_PZ2) ; off-sheet FAN_TACH
GBE_LED_ACT: J1.194(GBE_LED1) ; off-sheet GBE_LED_ACT
GBE_LED_LINK: J1.188(GBE_LED0) ; off-sheet GBE_LED_LINK
GBE_MDI0_N: J1.184(GBE_MDI0_N) ; off-sheet GBE_MDI0_N
GBE_MDI0_P: J1.186(GBE_MDI0_P) ; off-sheet GBE_MDI0_P
GBE_MDI1_N: J1.190(GBE_MDI1_N) ; off-sheet GBE_MDI1_N
GBE_MDI1_P: J1.192(GBE_MDI1_P) ; off-sheet GBE_MDI1_P
GBE_MDI2_N: J1.196(GBE_MDI2_N) ; off-sheet GBE_MDI2_N
GBE_MDI2_P: J1.198(GBE_MDI2_P) ; off-sheet GBE_MDI2_P
GBE_MDI3_N: J1.202(GBE_MDI3_N) ; off-sheet GBE_MDI3_N
GBE_MDI3_P: J1.204(GBE_MDI3_P) ; off-sheet GBE_MDI3_P
GPIO01: J1.118(CAM_AF_EN) ; off-sheet GPIO01
GPIO07: J1.206(LCD_BL_PWM) ; off-sheet GPIO07
GPIO09: J1.211(AUD_MCLK) ; off-sheet GPIO09
GPIO11: J1.216(GPIO_PZ0) ; off-sheet GPIO11
GPIO12: J1.218(LCD_TE) ; off-sheet GPIO12
GPIO13: J1.228(GPIO_PE6) ; off-sheet GPIO13
I2S0_LRCK: J1.197(DAP4_FS) ; off-sheet I2S0_LRCK
I2S0_SCLK: J1.199(DAP4_SCLK) ; off-sheet I2S0_SCLK
I2S0_SDIN: J1.195(DAP4_DIN) ; off-sheet I2S0_SDIN
I2S0_SDOUT: J1.193(DAP4_DOUT) ; off-sheet I2S0_SDOUT
I2S1_LRCK: J1.224(DAP3_FS) ; off-sheet I2S1_LRCK
I2S1_SCLK: J1.226(DAP3_SCLK) ; off-sheet I2S1_SCLK
I2S1_SDIN: J1.222(DAP3_DIN) ; off-sheet I2S1_SDIN
I2S1_SDOUT: J1.220(DAP3_DOUT) ; off-sheet I2S1_SDOUT
M2_ALERT*: J1.212(LCD_BL_EN) ; off-sheet M2_ALERT*
PCIE2_CLK_N: J1.52(CSI_C_CLK_N) ; off-sheet PCIE2_CLK_N
PCIE2_CLK_P: J1.54(CSI_C_CLK_P) ; off-sheet PCIE2_CLK_P
PCIE2_CLKREQ: J1.221(SDMMC3_DAT1) ; off-sheet PCIE2_CLKREQ
PCIE2_RST: J1.219(SDMMC3_DAT0) ; off-sheet PCIE2_RST
PCIE2_RX0_N: J1.40(CSI_D_D0_N) ; off-sheet PCIE2_RX0_N
PCIE2_RX0_P: J1.42(CSI_D_D0_P) ; off-sheet PCIE2_RX0_P
PCIE2_RX1_N: J1.58(CSI_C_D1_N) ; off-sheet PCIE2_RX1_N
PCIE2_RX1_P: J1.60(CSI_C_D1_P) ; off-sheet PCIE2_RX1_P
PCIE2_TX0_N: J1.46(CSI_C_D0_N) ; off-sheet PCIE2_TX0_N
PCIE2_TX0_P: J1.48(CSI_C_D0_P) ; off-sheet PCIE2_TX0_P
PCIE2_TX1_N: J1.64(CSI_D_D1_N) ; off-sheet PCIE2_TX1_N
PCIE2_TX1_P: J1.66(CSI_D_D1_P) ; off-sheet PCIE2_TX1_P
PCIE3_CLK_N: J1.227(SDMMC3_CMD) ; off-sheet PCIE3_CLK_N
PCIE3_CLK_P: J1.229(SDMMC3_CLK) ; off-sheet PCIE3_CLK_P
PCIE3_CLKREQ: J1.225(SDMMC3_DAT3) ; off-sheet PCIE3_CLKREQ
PCIE3_RST: J1.223(SDMMC3_DAT2) ; off-sheet PCIE3_RST
PWR_LED_CTRL: J1.127(NFC_INT) ; off-sheet PWR_LED_CTRL
SPI0_CS0: J1.95(SPI1_CS0) ; off-sheet SPI0_CS0
SPI0_CS1: J1.97(SPI1_CS1) ; off-sheet SPI0_CS1
SPI0_MISO: J1.93(SPI1_MISO) ; off-sheet SPI0_MISO
SPI0_MOSI: J1.89(SPI1_MOSI) ; off-sheet SPI0_MOSI
SPI0_SCK: J1.91(SPI1_SCK) ; off-sheet SPI0_SCK
SPI1_CS0: J1.110(SPI2_CS0) ; off-sheet SPI1_CS0
SPI1_CS1: J1.112(SPI2_CS1) ; off-sheet SPI1_CS1
SPI1_MISO: J1.108(SPI2_MISO) ; off-sheet SPI1_MISO
SPI1_MOSI: J1.104(SPI2_MOSI) ; off-sheet SPI1_MOSI
SPI1_SCK: J1.106(SPI2_SCK) ; off-sheet SPI1_SCK
USB0_AP_N: J1.109(USB0_DN) ; off-sheet USB0_AP_N
USB0_AP_P: J1.111(USB0_DP) ; off-sheet USB0_AP_P
USB0_VBUS_DET*: J1.87(USB_VBUS_EN0) ; off-sheet USB0_VBUS_DET*
USB1_AP_N: J1.115(USB1_DN) ; off-sheet USB1_AP_N
USB1_AP_P: J1.117(USB1_DP) ; off-sheet USB1_AP_P
USB2_AP_N: J1.121(USB2_DN) ; off-sheet USB2_AP_N
USB2_AP_P: J1.123(USB2_DP) ; off-sheet USB2_AP_P
W_DISABLE1_CTRL: J1.128(AP_WAKE_NFC) ; off-sheet W_DISABLE1_CTRL

### Notes on the sheet
- GPIOs, USB2.0, I2S, SPI, GBe and CSI
- OTG
- 90DIFF_NETCLASS1
- USB 3.0
- CAM1 FPC Con 2lane
- USB 2.0
- 50OHM_NETCLASS1
- 40Pin GPIO HDR
- 50OHM_NETCLASS2
- M.2 EKEY BT /  BKEY I2S
- CAM2 FPC Con 2lane
- ETHERNET CON
- PCIE2
- SD CARD
- USB3.1 HUB
- CAM FPC Con select
- (in symbol CON_SODIMM_260, part B) SODIMM CVB CON; SECTION 2 OF 3
- (in symbol radxa_1010) Size; Title:; REV; Page Name:; Date:; Sheet; of

### Library data of the parts
J1 = CON_SODIMM_260: as J1 on sheet 04_SODIMM connector 1_3; ANGLE: ?; ASSEMBLY: ?; EMI_GROUND_TAB: ?; GENDER: ?; LATCHING: ?; MAX_CURRENT: ?; MAX_VOLTAGE: ?; NV_NAME: ?; NV_PN: ?; PACK_TYPE: ?; PATH: ?; PITCH: ?; PLACEMENT_NOTE: ?; REFLOW: ?; SHIELDED: ?; SHROUDED: ?; SKU: COMMON; Value: CON_SODIMM_260; Part Type: 连接座; PCB Footprint: SODIMM_SM260_0D5_78D0X26D1
R19 = R: SMD  0402  4.7K  1/16W  ±1%  ROHS; Part Reference: R19; Part Number: A1R01.00250; PCB Footprint: R0402; Value: 4.7K 1%; Part Type: 贴片电阻
R21 = R: SMD  0402  4.7K  1/16W  ±1%  ROHS; Part Reference: R21; Part Number: A1R01.00250; PCB Footprint: R0402; Value: 4.7K 1%; Part Type: 贴片电阻
*#4 = radxa_1010: Page Create Date: March  8, 1995; Page Size: =PageSize; Page Modify Date: =ModifiedDate

## Sheet 06_SODIMM connector 3_3.SchDoc: C200
size 594 x 420 mm; Page Create Date: March  8, 1995; Page Number: 6; Page Size: A2; Comment: radxa_1010; Page Count: 21; RevCode: V1.11; Doc: 06_SODIMM connector 3_3; DsnPath: D:\WMS\C200\CC122\对外\C200 V1.11.DSN; SchematicName: c200; PageName: 06_SODIMM connector 3_3; PageSize: A2; TopSchematic: True
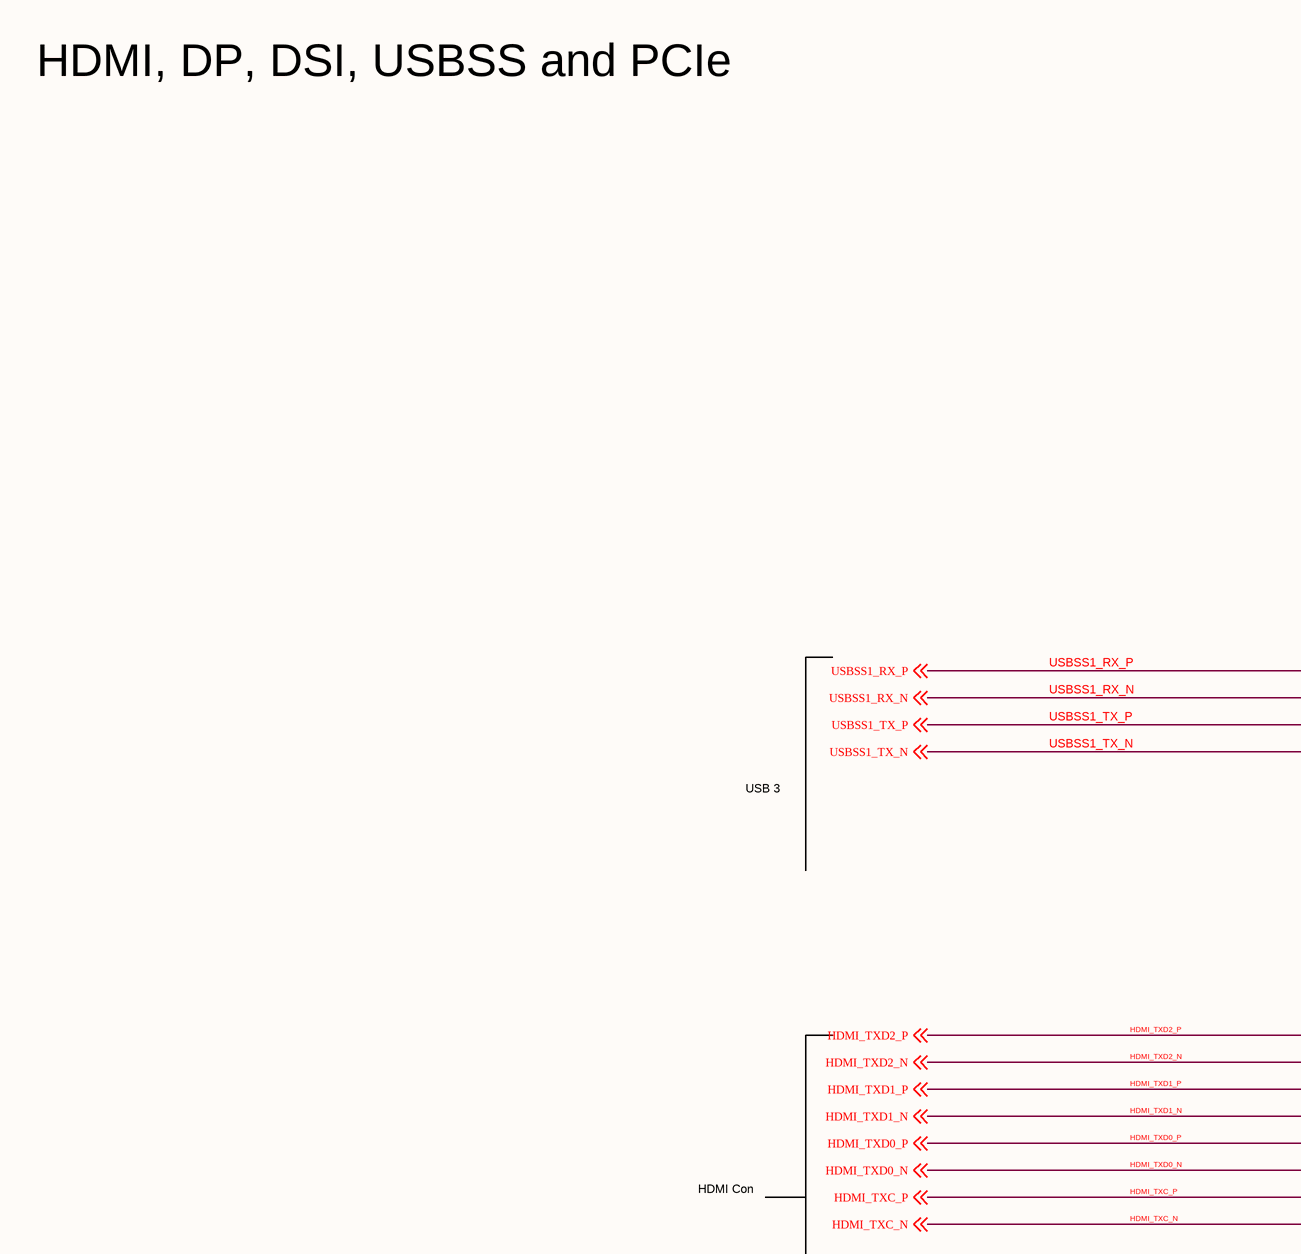
[diagram p10: 06_SODIMM connector 3_3.SchDoc, top left]
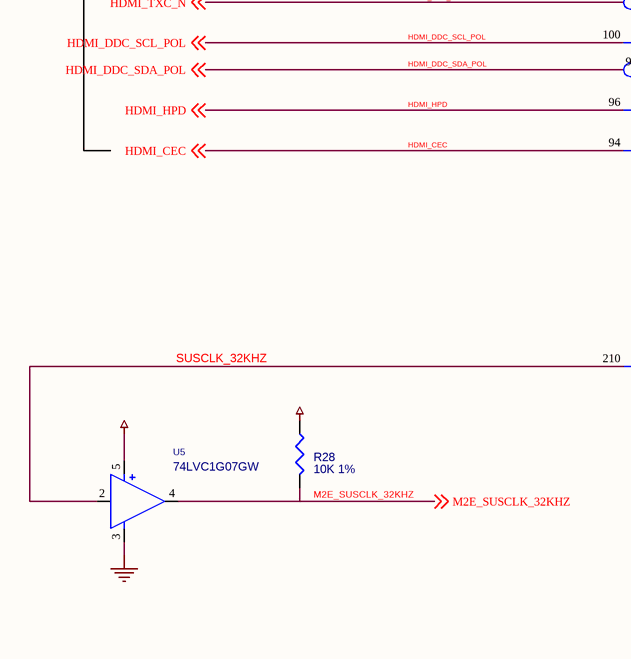
[diagram p11: 06_SODIMM connector 3_3.SchDoc, bottom left]
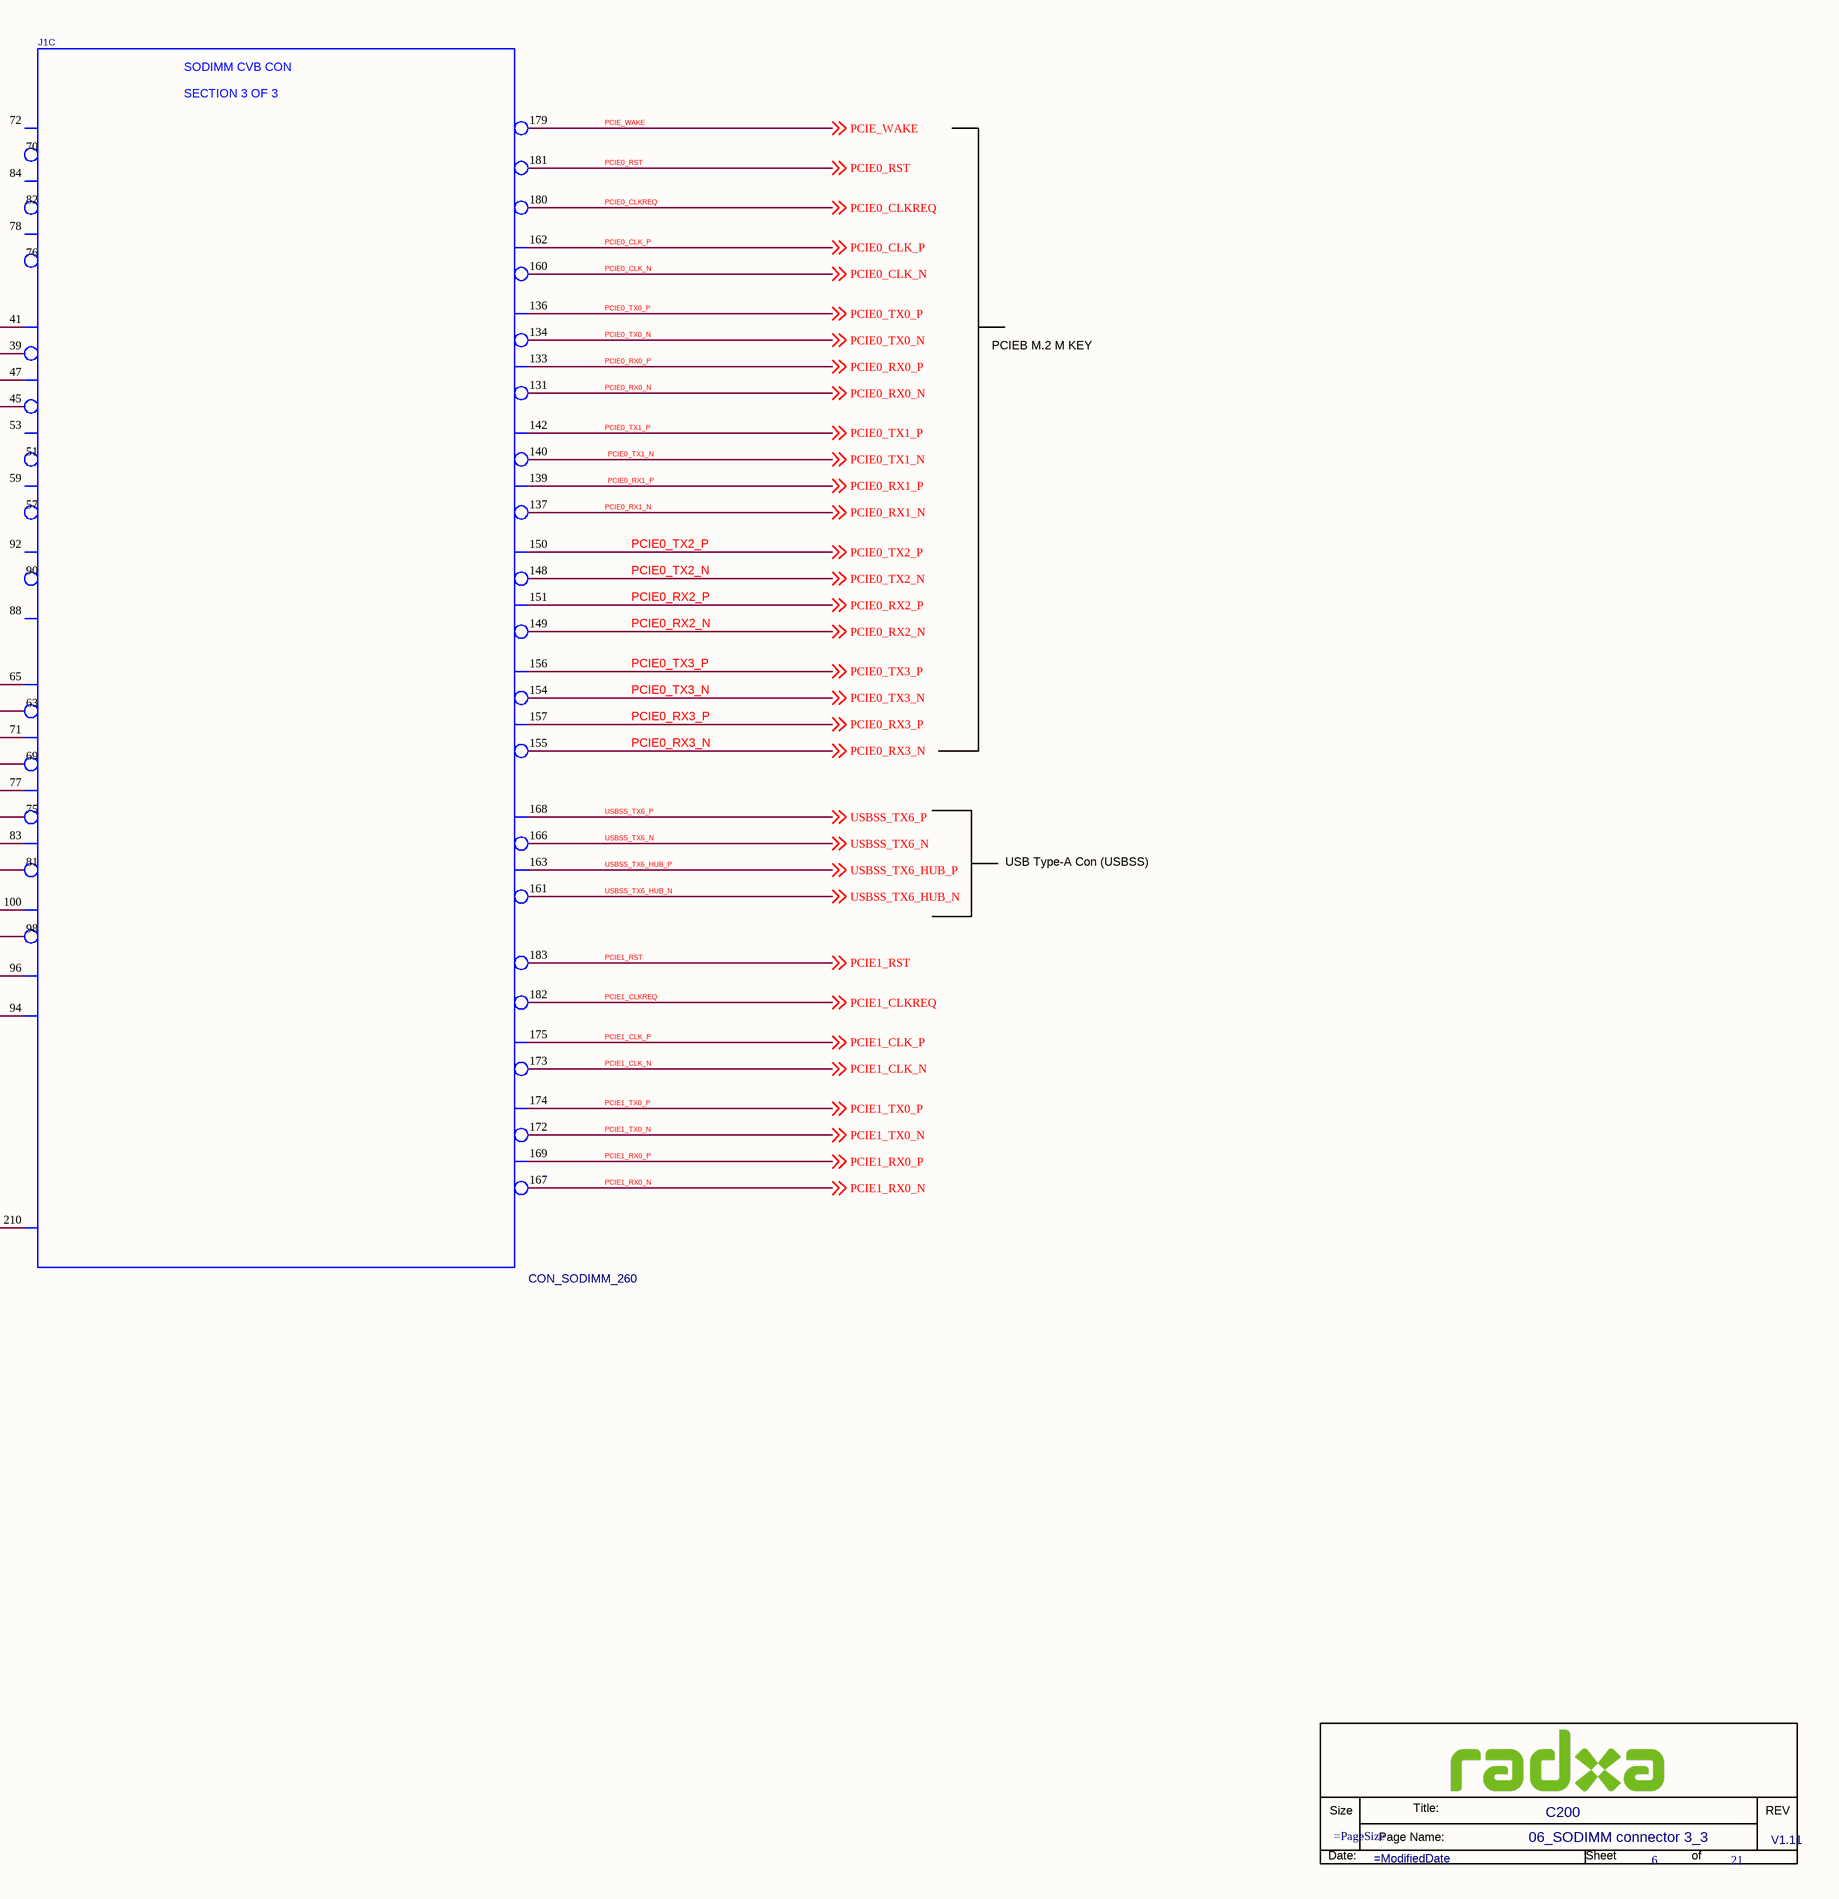
[diagram p12: 06_SODIMM connector 3_3.SchDoc, bottom right]

### Parts
(Parts that share a designator on the sheet are numbered #1, #2 ... from top to bottom, then left to right.)
*#5  Doc: 06_SODIMM connector 3_3  RevCode: V1.11  Title: C200  Page Number: 6  Page Count: 21  (hidden comment: radxa_1010)  (graphical)
J1  CON_SODIMM_260  [SODIMM_SM260_0D5_78D0X26D1]  (part C of 3)
R28  10K 1%  [R0402]
U5  74LVC1G07GW  [SC70_5]

### Nets
GND: U5.3(GND)  [project net HUB2_SSTX_N_J25]
VDD_1V8: U5.5(VCC)
VDD_3V3_SYS: R28.1  [project net 3V3]
HDMI_CEC: J1.94(HDMI_CEC) ; off-sheet HDMI_CEC
HDMI_DDC_SCL_POL: J1.100(DP_AUX_CH1_P) ; off-sheet HDMI_DDC_SCL_POL
HDMI_DDC_SDA_POL: J1.98(DP_AUX_CH1_N) ; off-sheet HDMI_DDC_SDA_POL
HDMI_HPD: J1.96(HDMI_INT_DP_HPD) ; off-sheet HDMI_HPD  [project net HDMI/DP/HPD]
HDMI_TXC_N: J1.81(HDMI_TXC_N) ; off-sheet HDMI_TXC_N  [project net DP1-TD3N/HDMI_TXC_N]
HDMI_TXC_P: J1.83(HDMI_TXC_P) ; off-sheet HDMI_TXC_P  [project net DP1-TD3P/HDMI_TXC_P]
HDMI_TXD0_N: J1.75(HDMI_TXD2_N) ; off-sheet HDMI_TXD0_N  [project net DP1-TD2N/HDMI_TXD0_N]
HDMI_TXD0_P: J1.77(HDMI_TXD2_P) ; off-sheet HDMI_TXD0_P  [project net DP1-TD2P/HDMI_TXD0_P]
HDMI_TXD1_N: J1.69(HDMI_TXD1_N) ; off-sheet HDMI_TXD1_N  [project net DP1-TD1N/HDMI_TXD1_N]
HDMI_TXD1_P: J1.71(HDMI_TXD1_P) ; off-sheet HDMI_TXD1_P  [project net DP1-TD1P/HDMI_TXD1_P]
HDMI_TXD2_N: J1.63(HDMI_TXD0_N) ; off-sheet HDMI_TXD2_N  [project net DP-TD0N/HDMI_TXD2_N]
HDMI_TXD2_P: J1.65(HDMI_TXD0_P) ; off-sheet HDMI_TXD2_P  [project net DP-TD0P/HDMI_TXD2_P]
M2E_SUSCLK_32KHZ: R28.2 U5.4(Y) ; off-sheet M2E_SUSCLK_32KHZ
PCIE0_CLK_N: J1.160(PEX_CLK1_N) ; off-sheet PCIE0_CLK_N
PCIE0_CLK_P: J1.162(PEX_CLK1_P) ; off-sheet PCIE0_CLK_P
PCIE0_CLKREQ: J1.180(PEX_L0_CLKREQ) ; off-sheet PCIE0_CLKREQ
PCIE0_RST: J1.181(PEX_L0_RST) ; off-sheet PCIE0_RST
PCIE0_RX0_N: J1.131(PEX_RX4_N) ; off-sheet PCIE0_RX0_N
PCIE0_RX0_P: J1.133(PEX_RX4_P) ; off-sheet PCIE0_RX0_P
PCIE0_RX1_N: J1.137(PEX_RX3_N) ; off-sheet PCIE0_RX1_N
PCIE0_RX1_P: J1.139(PEX_RX3_P) ; off-sheet PCIE0_RX1_P
PCIE0_RX2_N: J1.149(PEX_RX2_N) ; off-sheet PCIE0_RX2_N
PCIE0_RX2_P: J1.151(PEX_RX2_P) ; off-sheet PCIE0_RX2_P
PCIE0_RX3_N: J1.155(PEX_RX1_N) ; off-sheet PCIE0_RX3_N
PCIE0_RX3_P: J1.157(PEX_RX1_P) ; off-sheet PCIE0_RX3_P
PCIE0_TX0_N: J1.134(PEX_TX4_N) ; off-sheet PCIE0_TX0_N
PCIE0_TX0_P: J1.136(PEX_TX4_P) ; off-sheet PCIE0_TX0_P
PCIE0_TX1_N: J1.140(PEX_TX3_N) ; off-sheet PCIE0_TX1_N
PCIE0_TX1_P: J1.142(PEX_TX3_P) ; off-sheet PCIE0_TX1_P
PCIE0_TX2_N: J1.148(PEX_TX2_N) ; off-sheet PCIE0_TX2_N
PCIE0_TX2_P: J1.150(PEX_TX2_P) ; off-sheet PCIE0_TX2_P
PCIE0_TX3_N: J1.154(PEX_TX1_N) ; off-sheet PCIE0_TX3_N
PCIE0_TX3_P: J1.156(PEX_TX1_P) ; off-sheet PCIE0_TX3_P
PCIE1_CLK_N: J1.173(PEX_CLK2_N) ; off-sheet PCIE1_CLK_N
PCIE1_CLK_P: J1.175(PEX_CLK2_P) ; off-sheet PCIE1_CLK_P
PCIE1_CLKREQ: J1.182(PEX_L1_CLKREQ) ; off-sheet PCIE1_CLKREQ
PCIE1_RST: J1.183(PEX_L1_RST) ; off-sheet PCIE1_RST
PCIE1_RX0_N: J1.167(PEX_RX0_N) ; off-sheet PCIE1_RX0_N
PCIE1_RX0_P: J1.169(PEX_RX0_P) ; off-sheet PCIE1_RX0_P
PCIE1_TX0_N: J1.172(PEX_TX0_N) ; off-sheet PCIE1_TX0_N
PCIE1_TX0_P: J1.174(PEX_TX0_P) ; off-sheet PCIE1_TX0_P
PCIE_WAKE: J1.179(PEX_WAKE) ; off-sheet PCIE_WAKE
SUSCLK_32KHZ: J1.210(CLK_32K_OUT) U5.2(A)
USBSS1_RX_N: J1.39(EDP_TXD0_N) ; off-sheet USBSS1_RX_N
USBSS1_RX_P: J1.41(EDP_TXD0_P) ; off-sheet USBSS1_RX_P
USBSS1_TX_N: J1.45(EDP_TXD1_N) ; off-sheet USBSS1_TX_N
USBSS1_TX_P: J1.47(EDP_TXD1_P) ; off-sheet USBSS1_TX_P
USBSS_TX6_HUB_N: J1.161(PEX_RX6_N) ; off-sheet USBSS_TX6_HUB_N
USBSS_TX6_HUB_P: J1.163(PEX_RX6_P) ; off-sheet USBSS_TX6_HUB_P
USBSS_TX6_N: J1.166(PEX_TX6_N) ; off-sheet USBSS_TX6_N
USBSS_TX6_P: J1.168(PEX_TX6_P) ; off-sheet USBSS_TX6_P

Not connected (* = marked no-connect by the designer): J1 51(EDP_TXD2_N) 53(EDP_TXD2_P) 57(EDP_TXD3_N) 59(EDP_TXD3_P) 70(DSI_A_D0_N) 72(DSI_A_D0_P) 76(DSI_A_CLK_N) 78(DSI_A_CLK_P) 82(DSI_A_D1_N) 84(DSI_A_D1_P) 88(DP_HPD) 90(DP_AUX_CH0_N) 92(DP_AUX_CH0_P)

### Notes on the sheet
- HDMI, DP, DSI, USBSS and PCIe
- PCIEB M.2 M KEY
- USB 3
- HDMI Con
- USB Type-A Con (USBSS)
- (in symbol CON_SODIMM_260, part C) SODIMM CVB CON; SECTION 3 OF 3
- (in symbol radxa_1010) Size; Title:; REV; Page Name:; Date:; Sheet; of

### Library data of the parts
J1 = CON_SODIMM_260: SMD  母座  立贴  0.5mm脚距  AS0AA826-EASB0-7H  Foxconn  ROHS; Part Reference: J1; Part Number: A1J01.00015; CDS_PHYS_PART_NAME: CON_SODIMM_260_CON_SODIMM260_JETSON_NANO-2309413-1,FEMALE,0.5MM,90,[ ],[ ],YES,NO,NO,25 V,0.5 A,080-1656-000-080-1656-000; CDS_PART_NAME: CON_SODIMM_260_CON_SODIMM260_JETSON_NANO-2309413-1,FEMALE,0.5MM,90,[ ],[ ],YES,NO,NO,25 V,0.5 A,080-1656-000; ANGLE: 90; ASSEMBLY: CVB_CONN; EMI_GROUND_TAB: NO; GENDER: FEMALE; LATCHING: YES; MAX_CURRENT: 0.5 A; MAX_VOLTAGE: 25 V; NV_NAME: 2309413-1; NV_PN: 080-1656-000; PACK_TYPE: CON_SODIMM260_JETSON_NANO; PATH: I85; PITCH: 0.5mm; SHROUDED: [ ]; OriginalSymbolOrigin: (-950,2300); CaptureCellPackProp: CON_SODIMM_260C; SEC: 3; XY: (-6350,4050); VER: 8; ROT: 0; PHYS_PAGE: 6; DRAWING: @P3449_B01_LIB.P3449_B01(SCH_1):PAGE6; DEVICE_TYPENAME: CON_SODIMM_260_CON_SODIMM260_JETSON_NANO-2309413-1FEMALE05MM90YESNONO25V05A080-1656-000-080-1656-000; CDS_LIB: p3449_b01_lib; PLACEMENT_NOTE: ?; REFLOW: [ ]; SHIELDED: NO; SKU: COMMON; Value: CON_SODIMM_260; Part Type: 连接座; SEC_TYPE: CON_SODIMM260_JETSON_NANO; CHIPS_PART_NAME: CON_SODIMM_260; CDS_SEC: 3; PCB Footprint: SODIMM_SM260_0D5_78D0X26D1
R28 = R: SMD  0402  10K  1/16W  ±1%  ROHS; Part Reference: R28; Part Number: A1R01.00222; CDS_PHYS_PART_NAME: R_0402-10K,5 %,62.5MW,195-0486-000-10K,195-0486-000; CDS_PART_NAME: R_0402-10K,5 %,62.5MW,195-0486-000; SEC: 1; XY: (-8350,1250); VER: 2; TOL: 5%; SIGNAL_MODEL: nv_res; ROT: 0; PHYS_PAGE: 6; PATH: I87; PACK_TYPE: 402; NV_PN: 195-0486-000; MAX_WATTAGE: 62.5mW; LOCATION: R13; DRAWING: #NAME?; DEVICE_TYPENAME: R_0402-10K5625MW195-0486-000-10K195-0486-000; CDS_LIB: discrete; ASSEMBLY: M2_WIFIBT; PCB Footprint: R0402; Value: 10K 1%; Part Type: 贴片电阻; CHIPS_PART_NAME: R; CDS_SEC: 1
U5 = 74LVC1G07GW: SMD  缓冲器  74LVC1G07GW  SOT-353  TECH PUBLIC(台舟)  ROHS; Part Reference: U5; Part Number: A1I01.00080; OriginalSymbolOrigin: (-100,100); NC: 1; SKU: COMMON; PLACEMENT_NOTE: ?; PATH: ?; PACK_TYPE: ?; NV_PN: ?; NV_NAME: ?; FUNCTION: ?; ASSEMBLY: ?; Value: 74LVC1G07GW; Part Type: 集成电路/模块; PCB Footprint: SC70_5
*#5 = radxa_1010: Page Create Date: March  8, 1995; Page Size: =PageSize; Page Modify Date: =ModifiedDate